# Altium project SCB.PrjPCB (part 4 of 6)

## Sheet SCB_PLLs.SchDoc
size A3
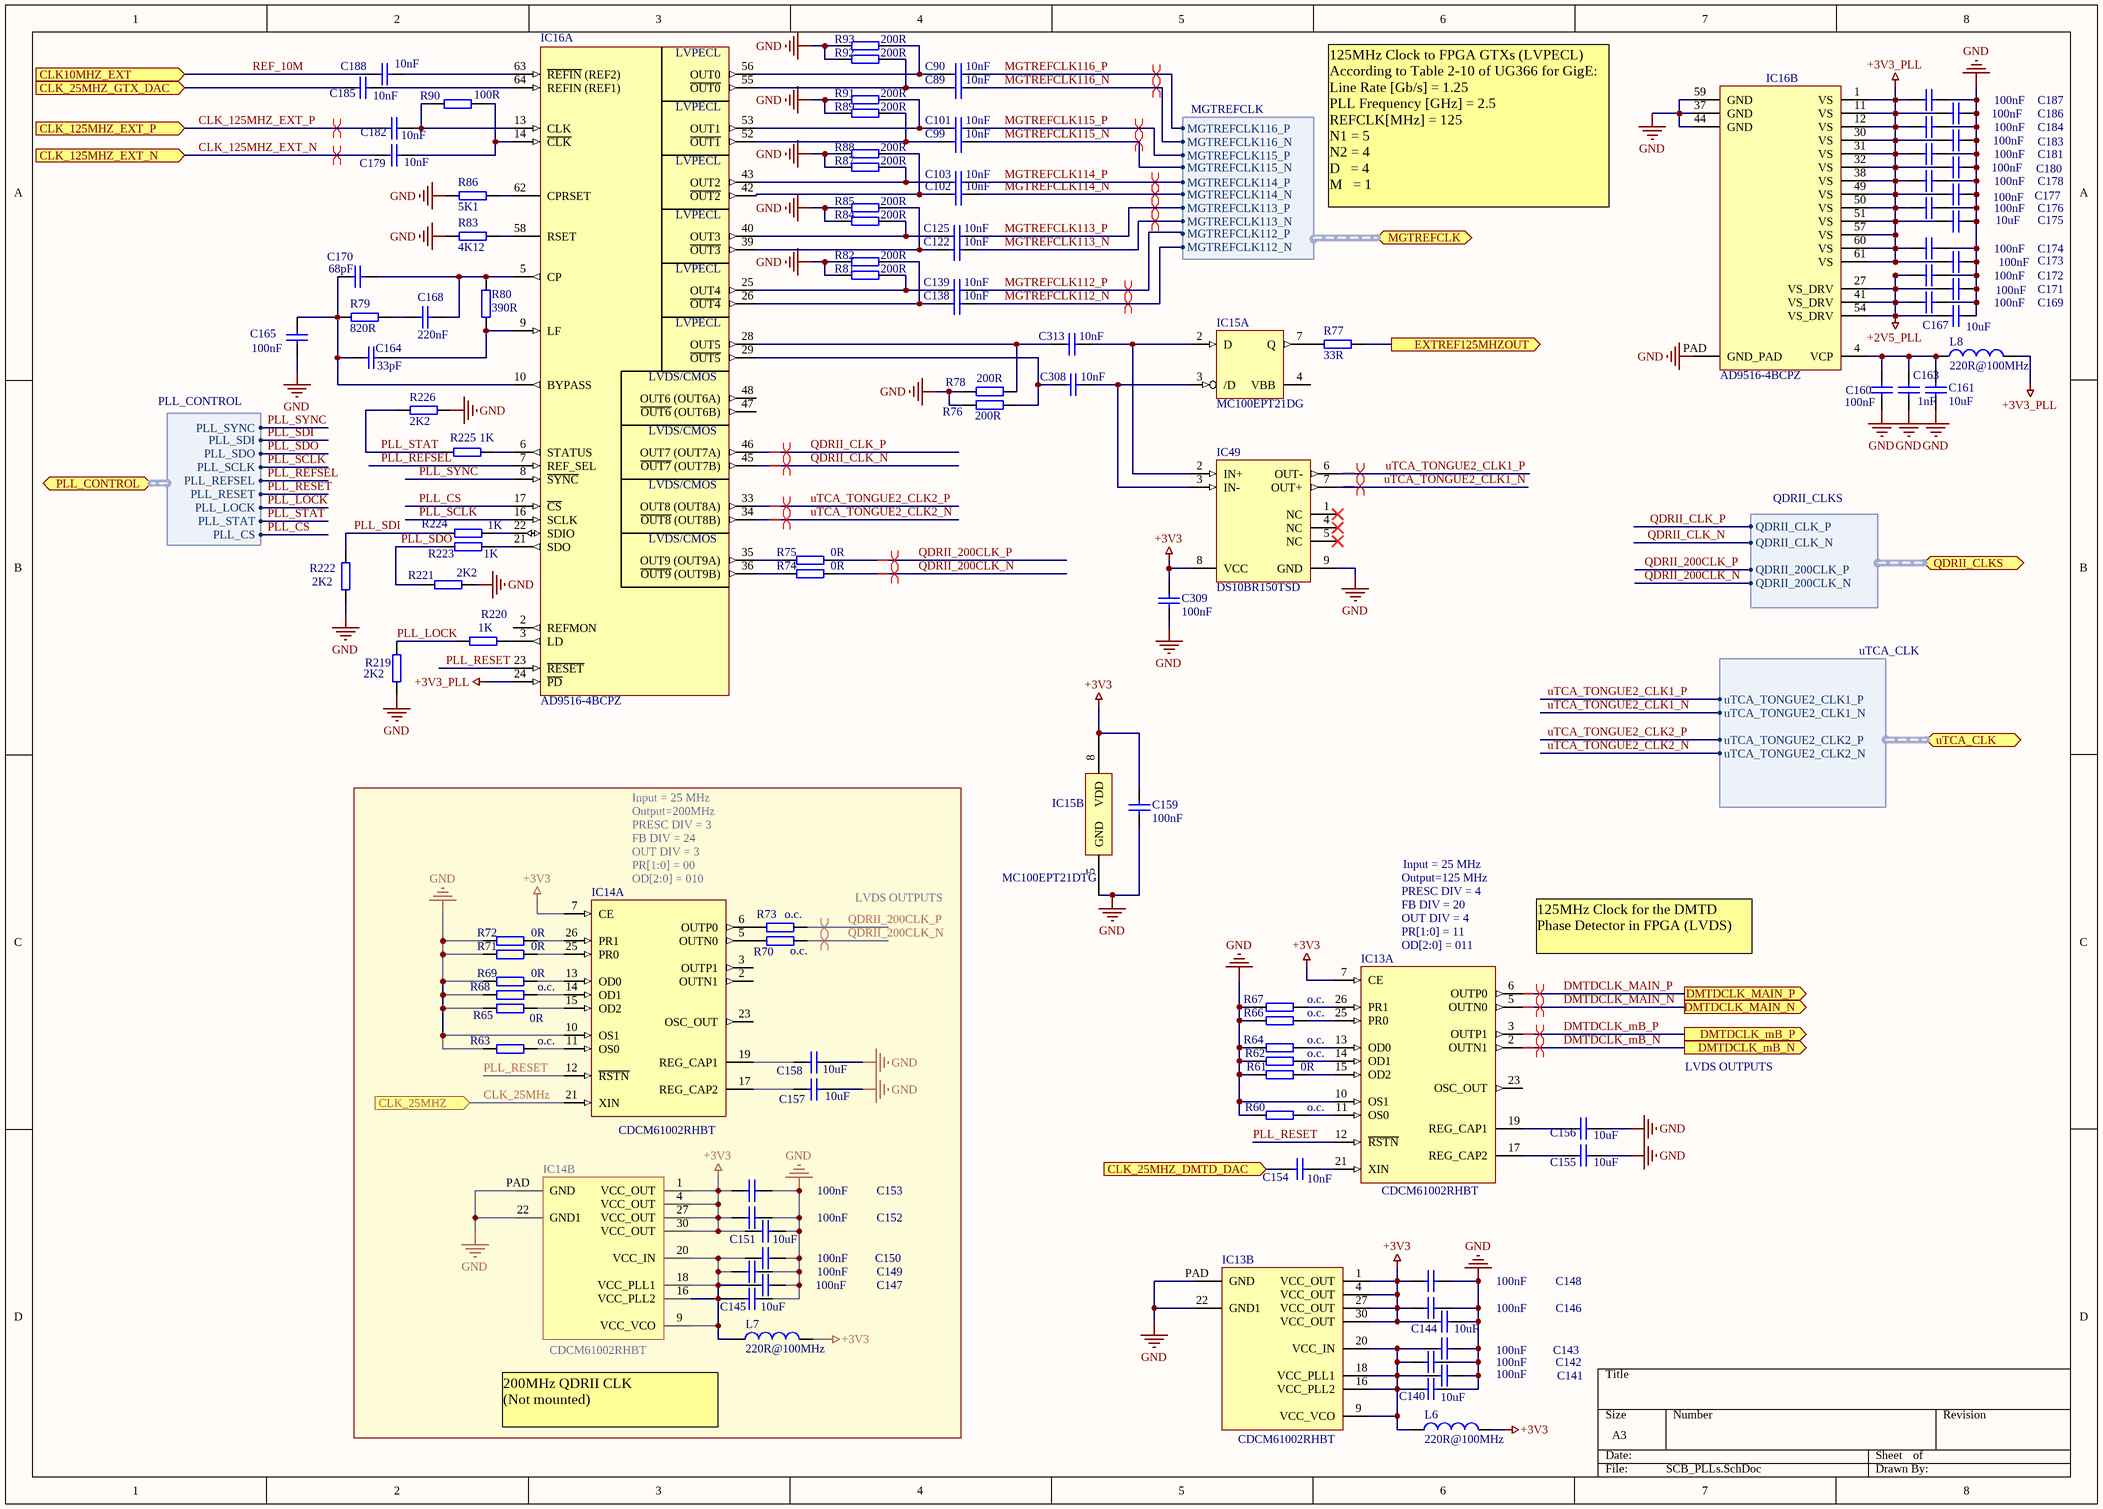
[diagram p14: SCB_PLLs.SchDoc]

### Parts
C89  10nF  [CC1005-0402]
C90  10nF  [CC1005-0402]
C99  10nF  [CC1005-0402]
C101  10nF  [CC1005-0402]
C102  10nF  [CC1005-0402]
C103  10nF  [CC1005-0402]
C122  10nF  [CC1005-0402]
C125  10nF  [CC1005-0402]
C138  10nF  [CC1005-0402]
C139  10nF  [CC1005-0402]
C140  10uF  [CC1608-0603]
C141  100nF  [CC1005-0402]
C142  100nF  [CC1005-0402]
C143  100nF  [CC1005-0402]
C144  10uF  [CC1608-0603]
C145  10uF  [CC1608-0603]
C146  100nF  [CC1005-0402]
C147  100nF  [CC1005-0402]
C148  100nF  [CC1005-0402]
C149  100nF  [CC1005-0402]
C150  100nF  [CC1005-0402]
C151  10uF  [CC1608-0603]
C152  100nF  [CC1005-0402]
C153  100nF  [CC1005-0402]
C154  10nF  [CC1005-0402]
C155  10uF  [CC1608-0603]
C156  10uF  [CC1608-0603]
C157  10uF  [CC1608-0603]
C158  10uF  [CC1608-0603]
C159  100nF  [CC1005-0402]
C160  100nF  [CC1005-0402]
C161  10uF  [CC1608-0603]
C163  1nF  [CC1005-0402]
C164  33pF  [CC1608-0603]
C165  100nF  [CC1608-0603]
C167  10uF  [CC1608-0603]
C168  220nF  [CC1608-0603]
C169  100nF  [CC1005-0402]
C170  68pF  [CC1608-0603]
C171  100nF  [CC1005-0402]
C172  100nF  [CC1005-0402]
C173  100nF  [CC1005-0402]
C174  100nF  [CC1005-0402]
C175  10uF  [CC1608-0603]
C176  100nF  [CC1005-0402]
C177  100nF  [CC1005-0402]
C178  100nF  [CC1005-0402]
C179  10nF  [CC1005-0402]
C180  100nF  [CC1005-0402]
C181  100nF  [CC1005-0402]
C182  10nF  [CC1005-0402]
C183  100nF  [CC1005-0402]
C184  100nF  [CC1005-0402]
C185  10nF  [CC1005-0402]
C186  100nF  [CC1005-0402]
C187  100nF  [CC1005-0402]
C188  10nF  [CC1005-0402]
C308  10nF  [CC1005-0402]
C309  100nF  [CC1005-0402]
C313  10nF  [CC1005-0402]
IC13  CDCM61002RHBT  [QFN32_POWERPAD]  (parts A,B of 2)
IC14  CDCM61002RHBT  [QFN32_POWERPAD]  (parts A,B of 2)
IC15  MC100EPT21DG  [SOIC127P600-8AL]  (parts A,B of 2)
IC16  AD9516-4BCPZ  [QFN50P900X900X100-64M]  (parts A,B of 2)
IC49  DS10BR150TSD  [SDA08A]
L6  Impedance: 220R@100MHz  [0603]  (hidden comment: 220R@100MHz Ferrite Bead)
L7  Impedance: 220R@100MHz  [0603]  (hidden comment: 220R@100MHz Ferrite Bead)
L8  Impedance: 220R@100MHz  [0603]  (hidden comment: 220R@100MHz Ferrite Bead)
R60  o.c.  [0402]
R61  value 0R  [0402]  (hidden comment: Jumper)
R62  o.c.  [0402]
R63  o.c.  [0402]
R64  o.c.  [0402]
R65  value 0R  [0402]  (hidden comment: Jumper)
R66  o.c.  [0402]
R67  o.c.  [0402]
R68  o.c.  [0402]
R69  value 0R  [0402]  (hidden comment: Jumper)
R70  o.c.  [0402]
R71  value 0R  [0402]  (hidden comment: Jumper)
R72  value 0R  [0402]  (hidden comment: Jumper)
R73  o.c.  [0402]
R74  value 0R  [0402]  (hidden comment: Jumper)
R75  value 0R  [0402]  (hidden comment: Jumper)
R76  200R  [0402]
R77  33R  [0603]
R78  200R  [0402]
R79  820R  [0603]
R80  390R  [0603]
R81  200R  [0402]
R82  200R  [0402]
R83  4K12  [0402]
R84  200R  [0402]
R85  200R  [0402]
R86  5K1  [0402]
R87  200R  [0402]
R88  200R  [0402]
R89  200R  [0402]
R90  100R  [0402]
R91  200R  [0402]
R92  200R  [0402]
R93  200R  [0402]
R219  2K2  [0402]
R220  1K  [0402]
R221  2K2  [0402]
R222  2K2  [0402]
R223  1K  [0402]
R224  1K  [0402]
R225  1K  [0402]
R226  2K2  [0402]

### Ports
CLK10MHZ_EXT (in), CLK_25MHZ (in), CLK_25MHZ_DMTD_DAC (in), CLK_25MHZ_GTX_DAC (in), CLK_125MHZ_EXT_N (in), CLK_125MHZ_EXT_P (in), DMTDCLK_MAIN_N (out), DMTDCLK_MAIN_P (out), DMTDCLK_mB_N (out), DMTDCLK_mB_P (out), EXTREF125MHZOUT (out), MGTREFCLK (harness MGTREFCLK), PLL_CONTROL (harness PLL_CONTROL), QDRII_CLKS (harness QDRII_CLKS), uTCA_CLK (harness uTCA_CLK)

### Harnesses
PLL_CONTROL: PLL_CS, PLL_STAT, PLL_LOCK, PLL_RESET, PLL_REFSEL, PLL_SCLK, PLL_SDO, PLL_SDI, PLL_SYNC
QDRII_CLKS: QDRII_CLK_P, QDRII_CLK_N, QDRII_200CLK_P, QDRII_200CLK_N
MGTREFCLK: MGTREFCLK112_P, MGTREFCLK112_N, MGTREFCLK113_P, MGTREFCLK113_N, MGTREFCLK114_P, MGTREFCLK114_N, MGTREFCLK115_P, MGTREFCLK115_N, MGTREFCLK116_P, MGTREFCLK116_N
uTCA_CLK: uTCA_TONGUE2_CLK1_P, uTCA_TONGUE2_CLK1_N, uTCA_TONGUE2_CLK2_P, uTCA_TONGUE2_CLK2_N

### Nets
+2V5_PLL: C167.1 C169.2 C171.2 C172.2 IC16.27(VS_DRV) IC16.41(VS_DRV) IC16.54(VS_DRV)
+3V3: C144.1 C146.2 C148.2 C151.1 C152.2 C153.2 C159.1 C309.1 IC13.1(VCC_OUT) IC13.4(VCC_OUT) IC13.7(CE) IC13.27(VCC_OUT) IC13.30(VCC_OUT) IC14.1(VCC_OUT) IC14.4(VCC_OUT) IC14.7(CE) IC14.27(VCC_OUT) IC14.30(VCC_OUT) IC15.8(VDD) IC49.8(VCC) L6.2 L7.2
+3V3_PLL: C173.2 C174.2 C175.1 C176.2 C177.2 C178.2 C180.2 C181.2 C183.2 C184.2 C186.2 C187.2 IC16.1(VS) IC16.11(VS) IC16.12(VS) IC16.24(~{PD}) IC16.30(VS) IC16.31(VS) IC16.32(VS) IC16.38(VS) IC16.49(VS) IC16.50(VS) IC16.51(VS) IC16.57(VS) IC16.60(VS) IC16.61(VS) L8.2
GND: C140.2 C141.1 C142.1 C143.1 C144.2 C145.2 C146.1 C147.1 C148.1 C149.1 C150.1 C151.2 C152.1 C153.1 C155.2 C156.2 C157.2 C158.2 C159.2 C160.2 C161.1 C163.1 C165.1 C167.2 C169.1 C171.1 C172.1 C173.1 C174.1 C175.2 C176.1 C177.1 C178.1 C180.1 C181.1 C183.1 C184.1 C186.1 C187.1 C309.2 IC13.10(OS1) IC13.22(GND1) IC13.PAD(GND) IC14.10(OS1) IC14.22(GND1) IC14.PAD(GND) IC15.5(GND) IC16.37(GND) IC16.44(GND) IC16.59(GND) IC16.PAD(GND_PAD) IC49.9(GND) R60.2 R61.1 R62.2 R63.2 R64.2 R65.1 R66.2 R67.2 R68.2 R69.1 R71.1 R72.1 R76.2 R78.2 R81.2 R82.2 R83.1 R84.2 R85.2 R86.1 R87.2 R88.2 R89.2 R91.2 R92.2 R93.2 R219.2 R221.2 R222.2 R226.2
CLK_25MHz: IC14.21(XIN) ; port CLK_25MHZ
CLK_125MHZ_EXT_N: C179.1 ; port CLK_125MHZ_EXT_N  [project net CLK125MHZ_EXT_N]
CLK_125MHZ_EXT_P: C182.1 ; port CLK_125MHZ_EXT_P  [project net CLK125MHZ_EXT_P]
DMTDCLK_MAIN_N: IC13.5(OUTN0) ; port DMTDCLK_MAIN_N  [project net DMTD_CLK_N]
DMTDCLK_MAIN_P: IC13.6(OUTP0) ; port DMTDCLK_MAIN_P  [project net DMTD_CLK_P]
DMTDCLK_mB_N: IC13.2(OUTN1) ; port DMTDCLK_mB_N
DMTDCLK_mB_P: IC13.3(OUTP1) ; port DMTDCLK_mB_P
MGTREFCLK112_N: C138.1 ; port MGTREFCLK.MGTREFCLK112_N  [project net MGTREFCLK.MGTREFCLK112_N]
MGTREFCLK112_P: C139.1 ; port MGTREFCLK.MGTREFCLK112_P  [project net MGTREFCLK.MGTREFCLK112_P]
MGTREFCLK113_N: C122.1 ; port MGTREFCLK.MGTREFCLK113_N  [project net MGTREFCLK.MGTREFCLK113_N]
MGTREFCLK113_P: C125.1 ; port MGTREFCLK.MGTREFCLK113_P  [project net MGTREFCLK.MGTREFCLK113_P]
MGTREFCLK114_N: C102.1 ; port MGTREFCLK.MGTREFCLK114_N  [project net MGTREFCLK.MGTREFCLK114_N]
MGTREFCLK114_P: C103.1 ; port MGTREFCLK.MGTREFCLK114_P  [project net MGTREFCLK.MGTREFCLK114_P]
MGTREFCLK115_N: C99.1 ; port MGTREFCLK.MGTREFCLK115_N  [project net MGTREFCLK.MGTREFCLK115_N]
MGTREFCLK115_P: C101.1 ; port MGTREFCLK.MGTREFCLK115_P  [project net MGTREFCLK.MGTREFCLK115_P]
MGTREFCLK116_N: C89.1 ; port MGTREFCLK.MGTREFCLK116_N  [project net MGTREFCLK.MGTREFCLK116_N]
MGTREFCLK116_P: C90.1 ; port MGTREFCLK.MGTREFCLK116_P  [project net MGTREFCLK.MGTREFCLK116_P]
PLL_CS: IC16.17(~{CS}) ; port PLL_CONTROL.PLL_CS  [project net PLL_CONTROL.PLL_CS]
PLL_LOCK: R219.1 R220.2 ; port PLL_CONTROL.PLL_LOCK  [project net PLL_CONTROL.PLL_LOCK]
PLL_REFSEL: IC16.7(REF_SEL) ; port PLL_CONTROL.PLL_REFSEL  [project net PLL_CONTROL.PLL_REFSEL]
PLL_RESET: IC13.12(~{RSTN}) IC14.12(~{RSTN}) IC16.23(~{RESET}) ; port PLL_CONTROL.PLL_RESET  [project net PLL_CONTROL.PLL_RESET]
PLL_SCLK: IC16.16(SCLK) ; port PLL_CONTROL.PLL_SCLK  [project net PLL_CONTROL.PLL_SCLK]
PLL_SDI: R222.1 R224.2 ; port PLL_CONTROL.PLL_SDI  [project net PLL_CONTROL.PLL_SDI]
PLL_SDO: R221.1 R223.2 ; port PLL_CONTROL.PLL_SDO  [project net PLL_CONTROL.PLL_SDO]
PLL_STAT: R225.2 R226.1 ; port PLL_CONTROL.PLL_STAT  [project net PLL_CONTROL.PLL_STAT]
PLL_SYNC: IC16.8(~{SYNC}) ; port PLL_CONTROL.PLL_SYNC  [project net PLL_CONTROL.PLL_SYNC]
QDRII_200CLK_N: R70.1 R74.2 ; port QDRII_CLKS.QDRII_200CLK_N
QDRII_200CLK_P: R73.1 R75.2 ; port QDRII_CLKS.QDRII_200CLK_P
QDRII_CLK_N: IC16.45(~{OUT7}_(OUT7B)) ; port QDRII_CLKS.QDRII_CLK_N
QDRII_CLK_P: IC16.46(OUT7_(OUT7A)) ; port QDRII_CLKS.QDRII_CLK_P
REF_10M: C188.1 ; port CLK10MHZ_EXT
uTCA_TONGUE2_CLK1_N: IC49.7(OUT+) ; port uTCA_CLK.uTCA_TONGUE2_CLK1_N  [project net uTCA_CLK.uTCA_TONGUE2_CLK1_N]
uTCA_TONGUE2_CLK1_P: IC49.6(OUT-) ; port uTCA_CLK.uTCA_TONGUE2_CLK1_P  [project net uTCA_CLK.uTCA_TONGUE2_CLK1_P]
uTCA_TONGUE2_CLK2_N: IC16.34(~{OUT8}_(OUT8B)) ; port uTCA_CLK.uTCA_TONGUE2_CLK2_N  [project net uTCA_CLK.uTCA_TONGUE2_CLK2_N]
uTCA_TONGUE2_CLK2_P: IC16.33(OUT8_(OUT8A)) ; port uTCA_CLK.uTCA_TONGUE2_CLK2_P  [project net uTCA_CLK.uTCA_TONGUE2_CLK2_P]
NetC89_2: C89.2 IC16.55(~{OUT0}) R92.1
NetC90_2: C90.2 IC16.56(OUT0) R93.1
NetC99_2: C99.2 IC16.52(~{OUT1}) R89.1
NetC101_2: C101.2 IC16.53(OUT1) R91.1
NetC102_2: C102.2 IC16.42(~{OUT2}) R88.1
NetC103_2: C103.2 IC16.43(OUT2) R87.1
NetC122_2: C122.2 IC16.39(~{OUT3}) R85.1
NetC125_2: C125.2 IC16.40(OUT3) R84.1
NetC138_2: C138.2 IC16.26(~{OUT4}) R82.1
NetC139_2: C139.2 IC16.25(OUT4) R81.1
NetC140_1: C140.1 C141.2 C142.2 C143.2 IC13.9(VCC_VCO) IC13.16(VCC_PLL2) IC13.18(VCC_PLL1) IC13.20(VCC_IN) L6.1
NetC145_1: C145.1 C147.2 C149.2 C150.2 IC14.9(VCC_VCO) IC14.16(VCC_PLL2) IC14.18(VCC_PLL1) IC14.20(VCC_IN) L7.1
NetC154_1: C154.1 IC13.21(XIN)
NetC154_2: C154.2 ; port CLK_25MHZ_DMTD_DAC
NetC155_1: C155.1 IC13.17(REG_CAP2)
NetC156_1: C156.1 IC13.19(REG_CAP1)
NetC157_1: C157.1 IC14.17(REG_CAP2)
NetC158_1: C158.1 IC14.19(REG_CAP1)
NetC160_1: C160.1 C161.2 C163.2 IC16.4(VCP) L8.1
NetC164_1: C164.1 C165.2 C170.1 IC16.10(BYPASS) R79.1
NetC164_2: C164.2 IC16.9(LF) R80.1
NetC168_1: C168.1 R79.2
NetC168_2: C168.2 C170.2 IC16.5(CP) R80.2
NetC179_2: C179.2 IC16.14(~{CLK}) R90.1
NetC182_2: C182.2 IC16.13(CLK) R90.2
NetC185_1: C185.1 ; port CLK_25MHZ_GTX_DAC
NetC185_2: C185.2 IC16.64(REFIN_(REF1))
NetC188_2: C188.2 IC16.63(~{REFIN}_(REF2))
NetC308_1: C308.1 IC15.3(/D) IC49.3(IN-)
NetC308_2: C308.2 IC16.29(~{OUT5}) R76.1
NetC313_1: C313.1 IC15.2(D) IC49.2(IN+)
NetC313_2: C313.2 IC16.28(OUT5) R78.1
NetIC13_11: IC13.11(OS0) R60.1
NetIC13_13: IC13.13(OD0) R64.1
NetIC13_14: IC13.14(OD1) R62.1
NetIC13_15: IC13.15(OD2) R61.2
NetIC13_25: IC13.25(PR0) R66.1
NetIC13_26: IC13.26(PR1) R67.1
NetIC14_5: IC14.5(OUTN0) R70.2
NetIC14_6: IC14.6(OUTP0) R73.2
NetIC14_11: IC14.11(OS0) R63.1
NetIC14_13: IC14.13(OD0) R69.2
NetIC14_14: IC14.14(OD1) R68.1
NetIC14_15: IC14.15(OD2) R65.2
NetIC14_25: IC14.25(PR0) R71.2
NetIC14_26: IC14.26(PR1) R72.2
NetIC15_7: IC15.7(Q) R77.1
NetIC16_3: IC16.3(LD) R220.1
NetIC16_6: IC16.6(STATUS) R225.1
NetIC16_21: IC16.21(SDO) R223.1
NetIC16_22: IC16.22(SDIO) R224.1
NetIC16_35: IC16.35(OUT9_(OUT9A)) R75.1
NetIC16_36: IC16.36(~{OUT9}_(OUT9B)) R74.1
NetIC16_58: IC16.58(RSET) R83.2
NetIC16_62: IC16.62(CPRSET) R86.2
NetP1_1: R77.2 ; port EXTREF125MHZOUT

Not connected (* = marked no-connect by the designer): IC13 23(OSC_OUT); IC14 2(OUTN1) 3(OUTP1) 23(OSC_OUT); IC15 4(VBB); IC16 2(REFMON) 47(~{OUT6}_(OUT6B)) 48(OUT6_(OUT6A)); IC49 1(NC)* 4(NC)* 5(NC)*

### Layout directives
differential pair: (no net found under the mark), CLK125MHZ_EXT_N, CLK125MHZ_EXT_P, DMTD_CLK_N, DMTD_CLK_P, DMTDCLK_mB_N, DMTDCLK_mB_P, MGTREFCLK.MGTREFCLK112_N, MGTREFCLK.MGTREFCLK112_P, MGTREFCLK.MGTREFCLK113_N, MGTREFCLK.MGTREFCLK113_P, MGTREFCLK.MGTREFCLK114_N, MGTREFCLK.MGTREFCLK114_P, MGTREFCLK.MGTREFCLK115_N, MGTREFCLK.MGTREFCLK115_P, MGTREFCLK.MGTREFCLK116_N, MGTREFCLK.MGTREFCLK116_P, QDRII_200CLK_N, QDRII_200CLK_P, QDRII_CLK_N, QDRII_CLK_P, uTCA_CLK.uTCA_TONGUE2_CLK2_N, uTCA_CLK.uTCA_TONGUE2_CLK2_P

### Notes on the sheet
- 125MHz Clock to FPGA GTXs (LVPECL)
  According to Table 2-10 of UG366 for GigE:
  Line Rate [Gb/s] = 1.25
  PLL Frequency [GHz] = 2.5
  REFCLK[MHz] = 125
  N1 = 5
  N2 = 4
  D   = 4
  M   = 1
- Output=200MHz
- PRESC DIV = 3
- FB DIV = 24
- OUT DIV = 3
- Input = 25 MHz
- (near IC14) PR[1:0] = 00
- (near IC14) OD[2:0] = 010
- LVDS OUTPUTS
- Output=125 MHz
- PRESC DIV = 4
- FB DIV = 20
- OUT DIV = 4
- (near IC13) PR[1:0] = 11
- (near IC13) OD[2:0] = 011
- (near IC13) 125MHz Clock for the DMTD Phase Detector in FPGA (LVDS)
- 200MHz QDRII CLK
  (Not mounted)
- (in symbol AD9516, part A) LVPECL; LVDS/CMOS

### Library data of the parts
C89 C90 C99 C101-C103 C122 C125 C138 C139 C154 C179 C182 C185 C188 C308 C313 = CC0402_10NF_25V_10%_X7R: Capacitor; Manufacturer1: TDK; Manufacturer1 PN: C1005X7R1E103K; TC: X7R; Tolerance: ±10%; Voltage: 25V; Published: 8-Jun-2000; LatestRevisionDate: 17-Jul-2002; LatestRevisionNote: Re-released for DXP Platform.; PackageReference: RAD-0.3; Publisher: Altium Limited; Distributor1: Digikey; Distributor1 PN: 445-1260-1-ND; Case: 0402; Value: 10nF
C140 C144 C145 C151 C155-C158 C161 C167 C175 = CC0603_10UF_6.3V_20%_X5R: Capacitor; Manufacturer1: TDK; Manufacturer1 PN: C1608X5R0J106M; TC: X5R; Tolerance: ±20%; Voltage: 6.3V; Published: 8-Jun-2000; LatestRevisionDate: 17-Jul-2002; LatestRevisionNote: Re-released for DXP Platform.; PackageReference: RAD-0.3; Publisher: Altium Limited; Distributor1: Digikey; Distributor1 PN: 445-4112-1-ND; Case: 0603; Value: 10uF
C141-C143 C146-C150 C152 C153 C159 C160 C169 C171-C174 C176-C178 C180 C181 C183 C184 C186 C187 C309 = CC0402_100NF_16V_10%_X7R: Capacitor; Manufacturer1: TDK; Manufacturer1 PN: C1005X7R1C104K; TC: X7R; Tolerance: ±10%; Voltage: 16V; Published: 8-Jun-2000; LatestRevisionDate: 17-Jul-2002; LatestRevisionNote: Re-released for DXP Platform.; PackageReference: RAD-0.3; Publisher: Altium Limited; Distributor1: Digikey; Distributor1 PN: 445-4952-1-ND; Case: 0402; Value: 100nF
C163 = CC0402_1NF_25V_10%_X7R: Capacitor; Manufacturer1: TDK; Manufacturer1 PN: C1005X7R1E102K; TC: X7R; Tolerance: ±10%; Voltage: 25V; Published: 8-Jun-2000; LatestRevisionDate: 17-Jul-2002; LatestRevisionNote: Re-released for DXP Platform.; PackageReference: RAD-0.3; Publisher: Altium Limited; Distributor1: Digikey; Distributor1 PN: 445-4924-1-ND; Case: 0402; Value: 1nF
C164 = CC0603_33PF_50V_5%_NP0: Capacitor; Manufacturer1: TDK; Manufacturer1 PN: C1608C0G1H330J; TC: COG; Tolerance: ±5%; Voltage: 50V; Published: 8-Jun-2000; LatestRevisionDate: 17-Jul-2002; LatestRevisionNote: Re-released for DXP Platform.; PackageReference: RAD-0.3; Publisher: Altium Limited; Distributor1: Digikey; Distributor1 PN: 445-1275-1-ND; Case: 0402; Value: 33pF
C165 = CC0603_100NF_50V_10%_X7R: Capacitor; Manufacturer1: Phycomp; Manufacturer1 PN: CC0603KRX7R9BB104; TC: X7R; Tolerance: ±10%; Voltage: 50V; Published: 8-Jun-2000; LatestRevisionDate: 17-Jul-2002; LatestRevisionNote: Re-released for DXP Platform.; Publisher: Altium Limited; Distributor1: Digikey; Distributor1 PN: 311-1344-1-ND; Case: 0603; Value: 100nF
C168 = CC0603_220NF_10V_10%_X7R: Capacitor; Manufacturer1: Yageo; Manufacturer1 PN: CC0603KRX7R6BB224; TC: X7R; Tolerance: ±10%; Voltage: 10V; Published: 8-Jun-2000; LatestRevisionDate: 17-Jul-2002; LatestRevisionNote: Re-released for DXP Platform.; PackageReference: RAD-0.3; Publisher: Altium Limited; Distributor1: Digikey; Distributor1 PN: 311-1346-1-ND; Case: 0402; Value: 220nF
C170 = CC0603_68PF_50V_5%_NP0: Capacitor; Manufacturer1: TDK Corporation; Manufacturer1 PN: C1608C0G1H680J; TC: COG; Tolerance: ±5%; Voltage: 50V; Published: 8-Jun-2000; LatestRevisionDate: 17-Jul-2002; LatestRevisionNote: Re-released for DXP Platform.; PackageReference: RAD-0.3; Publisher: Altium Limited; Distributor1: Digikey; Distributor1 PN: 445-1279-1-ND; Case: 0402; Value: 68pF
IC13 IC14 = CDCM61002: Low Jitter Clock Generator, Two Outpust, Integrated VCO; Manufacturer: Texas Instruments; Value: CDCM61002RHBT; Distributor1: Digikey; Distributor1 PN: 296-24193-1-ND
IC15 = MC100EPT21: ONSemi LVDS/LVPECL -> LVTTL/LVCMOS buffer; RefId: MC100EPT21DGOS-ND; Supplier: Digikey; Value: MC100EPT21DG
IC16 = AD9516: PLL with clock fanout; Value: AD9516-4BCPZ; Distributor1 PN: AD9516-4BCPZ-ND; Distributor1: Digikey
IC49 = DS10BR150TSD: 1.0 Gbps LVDS Buffer/Repeater; Manufacturer: National Semiconductor; CompType: Interface IC; PackageTopMarking: ZXYTT*1R150; PowerWise: N; Published: 4-Dec-2008; DatasheetVersion: Nov-2007; PackageVersion: revA, Aug-2003; PackageReference: SDA08A; Publisher: Altium Limited; PackageDescription: LLP, Plastic, Dual, 3 x 3 x 0.8mm Body, 8 Lead, 0.5mm Pitch, No Pullback; PartNumber: DS10BR150TSD; RoHS: Y; PinCount: 8; DigiKeyPartNumber: DS10BR150TSDTR-ND; ComponentLink1Description: DS10BR150 Datasheet; ComponentLink1URL: http://www.national.com/ds/DS/DS10BR150.pdf; ComponentLink2Description: DS10BR150 Web Page; ComponentLink2URL: http://www.national.com/pf/DS/DS10BR150.html; ComponentLink3Description: SDA08A Package Page; ComponentLink3URL: http://www.national.com/packaging/folders/sda08a.html
L6-L8 = L_FERRITE_BEAD: ferrite bead; Manufacturer1: Murata; Manufacturer1 PN: BLM18KG221SN1D; Current Rating: 2.2A; DCR: 50mOhm; Case: 0603; Distributor1: Digikey; Distributor1 PN: 490-5255-1-ND
R60 R62-R64 R66-R68 R70 R73 = R0402_O.C.: SMD Resistor; Case: 0402; Manufacturer1: N/A; Manufacturer1 PN: N/A; Distributor1: N/A; Distributor1 PN: N/A; TCR: N/A; Power Rating: N/A; Tolerance: N/A; Value: o.c.
R61 R65 R69 R71 R72 R74 R75 = R0402_0R_0.1W_JUMPER: SMD Resistor; Manufacturer1: Panasonic; Manufacturer1 PN: ERJ-2GE0R00X; TCR: 100ppm; Power Rating: 0.1W; Case: 0402; Distributor1: DigiKey; Distributor1 PN: P0.0JCT-ND; Tolerance: Jumper
R76 R78 R81 R82 R84 R85 R87-R89 R91-R93 = R0402_200R_±1%_0.1W_100PPM: SMD Resistor; Manufacturer1: Panasonic; Manufacturer1 PN: ERJ-2RKF2000X; TCR: 100ppm; Power Rating: 0.1W; Tolerance: ±1%; Case: 0402; Distributor1: DigiKey; Distributor1 PN: P200LCT-ND; Value: 200R
R77 = R0603_33R_±1%_0.25W_100PPM: SMD Resistor; Manufacturer1: Vishay/Dale; Manufacturer1 PN: CRCW060333R0FKEAHP; TCR: 100ppm; Power Rating: 0.25W; Tolerance: ±1%; Case: 0402; Distributor1: DigiKey; Distributor1 PN: 541-33.0SCT-ND; Value: 33R
R79 = R0603_820R_±1%_0.1W_100PPM: SMD Resistor; Manufacturer1: Panasonic; Manufacturer1 PN: ERJ-3EKF8200V; TCR: 100ppm; Power Rating: 0.1W; Tolerance: ±1%; Case: 0603; Distributor1: DigiKey; Distributor1 PN: P820HCT-ND; Value: 820R
R80 = R0603_390R_±1%_0.1W_100PPM: SMD Resistor; Manufacturer1: Panasonic; Manufacturer1 PN: ERJ-3EKF3900V; TCR: 100ppm; Power Rating: 0.1W; Tolerance: ±1%; Case: 0603; Distributor1: DigiKey; Distributor1 PN: P390HCT-ND; Value: 390R
R83 = R0402_4K12_±1%_0.1W_100PPM: SMD Resistor; Manufacturer1: Panasonic; Manufacturer1 PN: ERJ-2RKF4121X; TCR: 100ppm; Power Rating: 0.1W; Tolerance: ±1%; Case: 0402; Distributor1: DigiKey; Distributor1 PN: P4.12KLCT-ND; Value: 4K12
R86 = R0402_5K1_±1%_0.1W_100PPM: SMD Resistor; Manufacturer1: Panasonic; Manufacturer1 PN: ERJ-2RKF5101X; TCR: 100ppm; Power Rating: 0.1W; Tolerance: ±1%; Case: 0402; Distributor1: DigiKey; Distributor1 PN: P5.10KLCT-ND; Value: 5K1
R90 = R0402_100R_±1%_0.1W_100PPM: SMD Resistor; Manufacturer1: Panasonic; Manufacturer1 PN: ERJ-2RKF1000X; TCR: 100ppm; Power Rating: 0.1W; Tolerance: ±1%; Case: 0402; Distributor1: DigiKey; Distributor1 PN: P100LCT-ND; Value: 100R
R219 R221 R222 R226 = R0402_2K2_±1%_0.1W_100PPM: SMD Resistor; Manufacturer1: Panasonic; Manufacturer1 PN: ERJ-2RKF2201X; TCR: 100ppm; Power Rating: 0.1W; Tolerance: ±1%; Case: 0402; Distributor1: DigiKey; Distributor1 PN: P2.20KLCT-ND; Value: 2K2
R220 R223-R225 = R0402_1K_±1%_0.1W_100PPM: as R160-R163 on sheet CPU_IO_Ports; Case: 0402; Distributor1: DigiKey; Distributor1 PN: P1.00KLCT-ND; Value: 1K

## Sheet FPGA_GPIOs.SchDoc
size A4
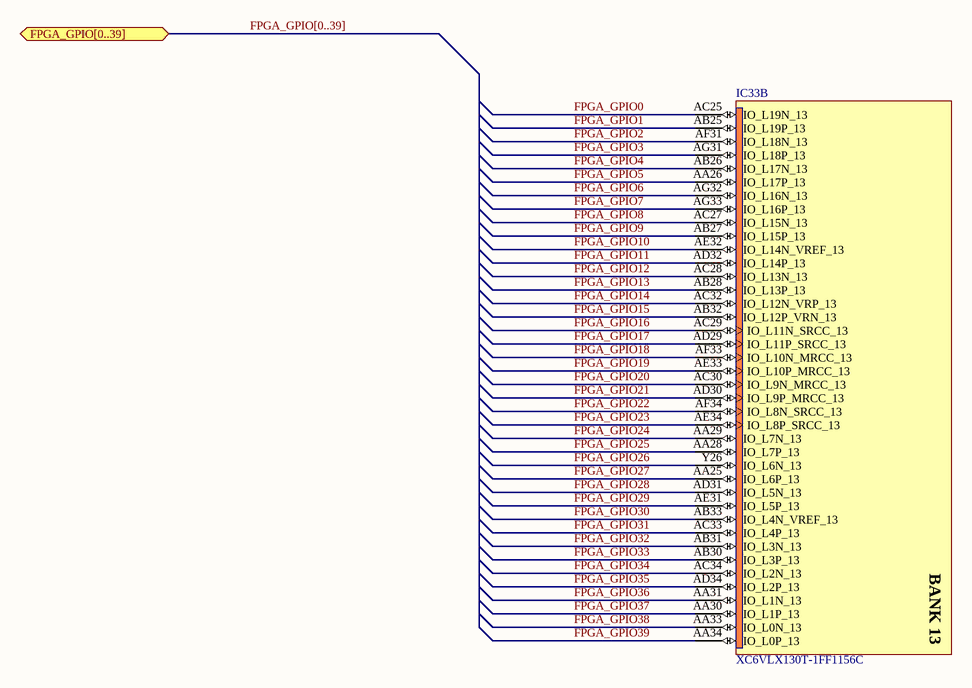
[diagram p15: FPGA_GPIOs.SchDoc]

### Parts
IC33  XC6VLX130T-1FF1156C  [FF1156]  (part B of 20)

### Ports
FPGA_GPIO[0..39] (bidir)

### Nets
FPGA_GPIO0: IC33.AC25(IO_L19N_13)
FPGA_GPIO1: IC33.AB25(IO_L19P_13)
FPGA_GPIO2: IC33.AF31(IO_L18N_13)
FPGA_GPIO3: IC33.AG31(IO_L18P_13)
FPGA_GPIO4: IC33.AB26(IO_L17N_13)
FPGA_GPIO5: IC33.AA26(IO_L17P_13)
FPGA_GPIO6: IC33.AG32(IO_L16N_13)
FPGA_GPIO7: IC33.AG33(IO_L16P_13)
FPGA_GPIO8: IC33.AC27(IO_L15N_13)
FPGA_GPIO9: IC33.AB27(IO_L15P_13)
FPGA_GPIO10: IC33.AE32(IO_L14N_VREF_13)
FPGA_GPIO11: IC33.AD32(IO_L14P_13)
FPGA_GPIO12: IC33.AC28(IO_L13N_13)
FPGA_GPIO13: IC33.AB28(IO_L13P_13)
FPGA_GPIO14: IC33.AC32(IO_L12N_VRP_13)
FPGA_GPIO15: IC33.AB32(IO_L12P_VRN_13)
FPGA_GPIO16: IC33.AC29(IO_L11N_SRCC_13)
FPGA_GPIO17: IC33.AD29(IO_L11P_SRCC_13)
FPGA_GPIO18: IC33.AF33(IO_L10N_MRCC_13)
FPGA_GPIO19: IC33.AE33(IO_L10P_MRCC_13)
FPGA_GPIO20: IC33.AC30(IO_L9N_MRCC_13)
FPGA_GPIO21: IC33.AD30(IO_L9P_MRCC_13)
FPGA_GPIO22: IC33.AF34(IO_L8N_SRCC_13)
FPGA_GPIO23: IC33.AE34(IO_L8P_SRCC_13)
FPGA_GPIO24: IC33.AA29(IO_L7N_13)
FPGA_GPIO25: IC33.AA28(IO_L7P_13)
FPGA_GPIO26: IC33.Y26(IO_L6N_13)
FPGA_GPIO27: IC33.AA25(IO_L6P_13)
FPGA_GPIO28: IC33.AD31(IO_L5N_13)
FPGA_GPIO29: IC33.AE31(IO_L5P_13)
FPGA_GPIO30: IC33.AB33(IO_L4N_VREF_13)
FPGA_GPIO31: IC33.AC33(IO_L4P_13)
FPGA_GPIO32: IC33.AB31(IO_L3N_13)
FPGA_GPIO33: IC33.AB30(IO_L3P_13)
FPGA_GPIO34: IC33.AC34(IO_L2N_13)
FPGA_GPIO35: IC33.AD34(IO_L2P_13)
FPGA_GPIO36: IC33.AA31(IO_L1N_13)
FPGA_GPIO37: IC33.AA30(IO_L1P_13)
FPGA_GPIO38: IC33.AA33(IO_L0N_13)
FPGA_GPIO39: IC33.AA34(IO_L0P_13)

### Buses and harness runs
bus FPGA_GPIO[0..39] = port FPGA_GPIO[0..39]

### Notes on the sheet
- (in symbol XC6VLX130T-1FF1156C, part B) BANK 13

### Library data of the parts
IC33 = XC6VLX130T-1FF1156C: Virtex-6 LXT Platform FPGA, 600 User I/Os, 20 GTXs, 1156-Ball FFBGA, Speed Grade 1, Commercial Grade; FirstPublished: 17-Nov-2009; DatasheetVersion: v2.0, Sep-2009; PackageVersion: ver1.0, Jun-2009; PackageReference: FF1156; Publisher: Altium Limited; PackageDescription: 1156-Ball Flip-Chip Fine Pitch Ball Grid Array (FF1156); Code_JEDEC: MS-034-AAR-1; Code_IPC: BGA100P34X34-1156; ComponentLink1Description: Virtex-6 Datasheet; ComponentLink1URL: http://www.xilinx.com/support/documentation/data_sheets/ds150.pdf; ComponentLink2Description: Pinout Specification; ComponentLink2URL: http://www.xilinx.com/support/packagefiles/virtex-6-pkgs.htm; ComponentLink3Description: FF1156 Package Drawing; ComponentLink3URL: http://www.xilinx.com/support/documentation/package_specs/ff1156.pdf; ComponentLink4Description: Virtex-6 Documents; ComponentLink4URL: http://www.xilinx.com/support/documentation/virtex-6.htm; ComponentLink5Description: Xilinx.com Home; ComponentLink5URL: http://www.xilinx.com

## Sheet FPGA_System_Monitor.SchDoc
size A3
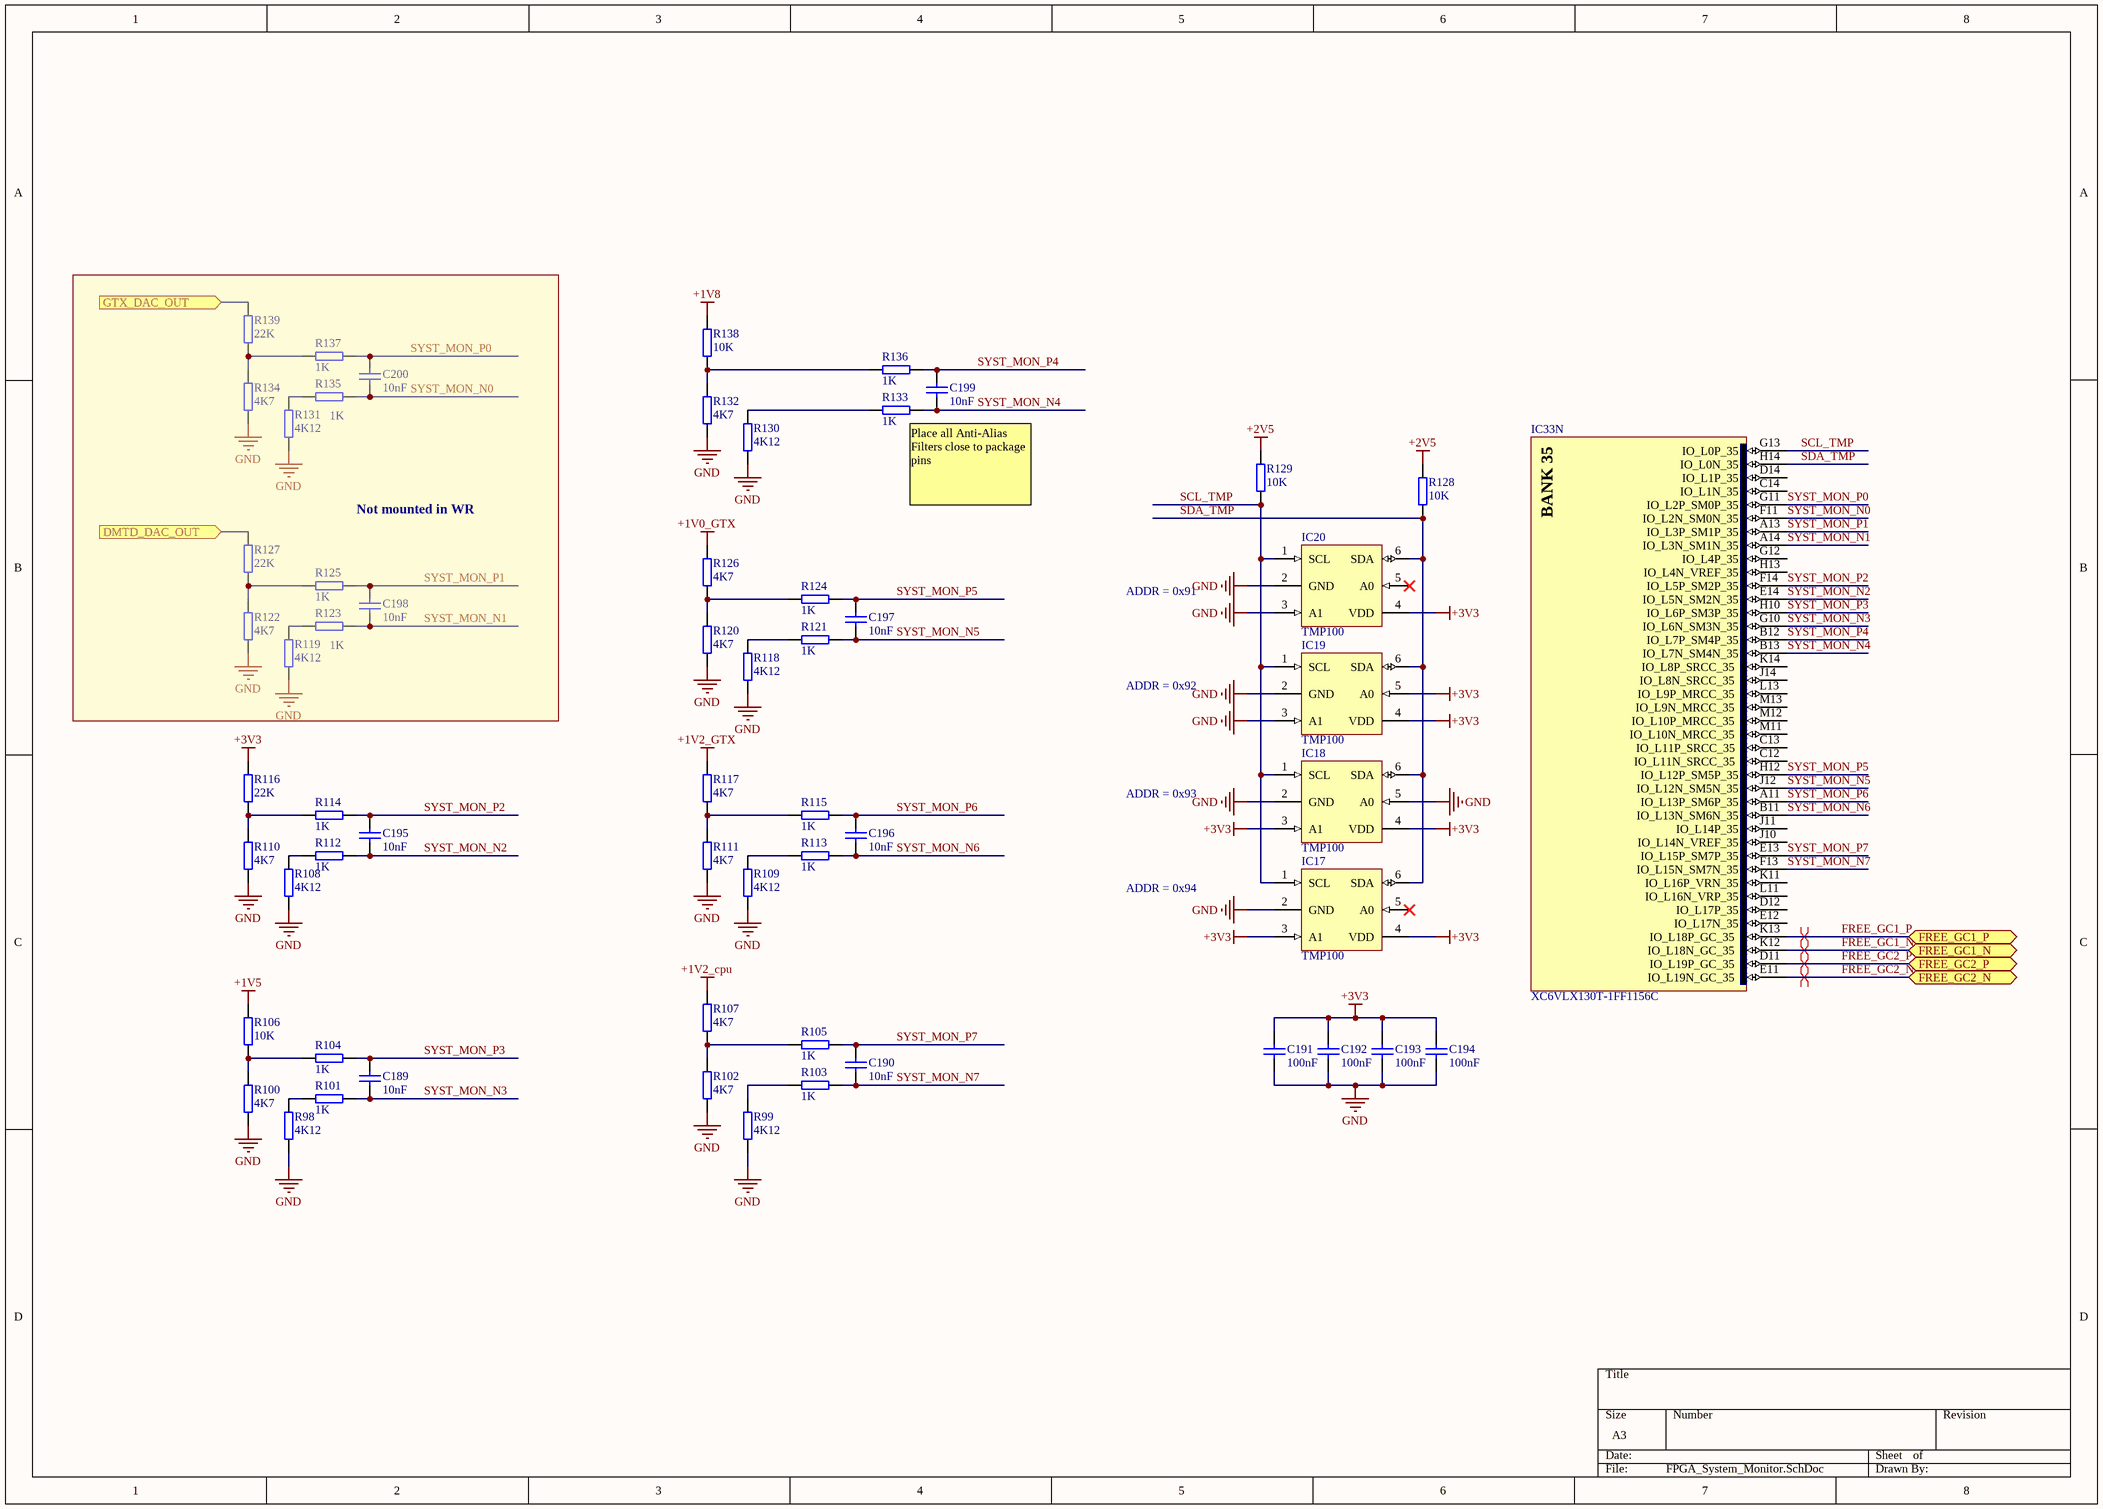
[diagram p16: FPGA_System_Monitor.SchDoc]

### Parts
C189  10nF  [CC1005-0402]
C190  10nF  [CC1005-0402]
C191  100nF  [CC1005-0402]
C192  100nF  [CC1005-0402]
C193  100nF  [CC1005-0402]
C194  100nF  [CC1005-0402]
C195  10nF  [CC1005-0402]
C196  10nF  [CC1005-0402]
C197  10nF  [CC1005-0402]
C198  10nF  [CC1005-0402]
C199  10nF  [CC1005-0402]
C200  10nF  [CC1005-0402]
IC17  TMP100  [SOT23A-6L]
IC18  TMP100  [SOT23A-6L]
IC19  TMP100  [SOT23A-6L]
IC20  TMP100  [SOT23A-6L]
IC33  XC6VLX130T-1FF1156C  [FF1156]  (part N of 20)
R98  4K12  [0402]
R99  4K12  [0402]
R100  4K7  [0402]
R101  1K  [0402]
R102  4K7  [0402]
R103  1K  [0402]
R104  1K  [0402]
R105  1K  [0402]
R106  10k  [0402]
R107  4K7  [0402]
R108  4K12  [0402]
R109  4K12  [0402]
R110  4K7  [0402]
R111  4K7  [0402]
R112  1K  [0402]
R113  1K  [0402]
R114  1K  [0402]
R115  1K  [0402]
R116  22K  [0402]
R117  4K7  [0402]
R118  4K12  [0402]
R119  4K12  [0402]
R120  4K7  [0402]
R121  1K  [0402]
R122  4K7  [0402]
R123  1K  [0402]
R124  1K  [0402]
R125  1K  [0402]
R126  4K7  [0402]
R127  22K  [0402]
R128  10k  [0402]
R129  10k  [0402]
R130  4K12  [0402]
R131  4K12  [0402]
R132  4K7  [0402]
R133  1K  [0402]
R134  4K7  [0402]
R135  1K  [0402]
R136  1K  [0402]
R137  1K  [0402]
R138  10k  [0402]
R139  22K  [0402]

### Blocks framed on the sheet
Not mounted in WR: C198 C200 R119 R122 R123 R125 R127 R131 R134 R135 R137 R139

### Ports
DMTD_DAC_OUT (in), FREE_GC1_N (bidir), FREE_GC1_P (bidir), FREE_GC2_N (bidir), FREE_GC2_P (bidir), GTX_DAC_OUT (in)

### Nets
+1V0_GTX: R126.2
+1V2_cpu: R107.2
+1V2_GTX: R117.2
+1V5: R106.2
+1V8: R138.2
+2V5: R128.2 R129.2
+3V3: C191.1 C192.1 C193.1 C194.1 IC17.3(A1) IC17.4(VDD) IC18.3(A1) IC18.4(VDD) IC19.4(VDD) IC19.5(A0) IC20.4(VDD) R116.2
GND: C191.2 C192.2 C193.2 C194.2 IC17.2(GND) IC18.2(GND) IC18.5(A0) IC19.2(GND) IC19.3(A1) IC20.2(GND) IC20.3(A1) R98.1 R99.1 R100.1 R102.1 R108.1 R109.1 R110.1 R111.1 R118.1 R119.1 R120.1 R122.1 R130.1 R131.1 R132.1 R134.1
FREE_GC1_N: IC33.K12(IO_L18N_GC_35) ; port FREE_GC1_N
FREE_GC1_P: IC33.K13(IO_L18P_GC_35) ; port FREE_GC1_P
FREE_GC2_N: IC33.E11(IO_L19N_GC_35) ; port FREE_GC2_N  [project net FPGA_GCLK_N]
FREE_GC2_P: IC33.D11(IO_L19P_GC_35) ; port FREE_GC2_P  [project net FPGA_GCLK_P]
SCL_TMP: IC17.1(SCL) IC18.1(SCL) IC19.1(SCL) IC20.1(SCL) IC33.G13(IO_L0P_35) R129.1
SDA_TMP: IC17.6(SDA) IC18.6(SDA) IC19.6(SDA) IC20.6(SDA) IC33.H14(IO_L0N_35) R128.1
SYST_MON_N0: C200.1 IC33.F11(IO_L2N_SM0N_35) R135.1
SYST_MON_N1: C198.1 IC33.A14(IO_L3N_SM1N_35) R123.1
SYST_MON_N2: C195.1 IC33.E14(IO_L5N_SM2N_35) R112.1
SYST_MON_N3: C189.1 IC33.G10(IO_L6N_SM3N_35) R101.1
SYST_MON_N4: C199.1 IC33.B13(IO_L7N_SM4N_35) R133.1
SYST_MON_N5: C197.1 IC33.J12(IO_L12N_SM5N_35) R121.1
SYST_MON_N6: C196.1 IC33.B11(IO_L13N_SM6N_35) R113.1
SYST_MON_N7: C190.1 IC33.F13(IO_L15N_SM7N_35) R103.1
SYST_MON_P0: C200.2 IC33.G11(IO_L2P_SM0P_35) R137.1
SYST_MON_P1: C198.2 IC33.A13(IO_L3P_SM1P_35) R125.1
SYST_MON_P2: C195.2 IC33.F14(IO_L5P_SM2P_35) R114.1
SYST_MON_P3: C189.2 IC33.H10(IO_L6P_SM3P_35) R104.1
SYST_MON_P4: C199.2 IC33.B12(IO_L7P_SM4P_35) R136.1
SYST_MON_P5: C197.2 IC33.H12(IO_L12P_SM5P_35) R124.1
SYST_MON_P6: C196.2 IC33.A11(IO_L13P_SM6P_35) R115.1
SYST_MON_P7: C190.2 IC33.E13(IO_L15P_SM7P_35) R105.1
NetIC5_3: R139.2 ; port GTX_DAC_OUT
NetIC8_3: R127.2 ; port DMTD_DAC_OUT
NetR98_2: R98.2 R101.2
NetR99_2: R99.2 R103.2
NetR100_2: R100.2 R104.2 R106.1
NetR102_2: R102.2 R105.2 R107.1
NetR108_2: R108.2 R112.2
NetR109_2: R109.2 R113.2
NetR110_2: R110.2 R114.2 R116.1
NetR111_2: R111.2 R115.2 R117.1
NetR118_2: R118.2 R121.2
NetR119_2: R119.2 R123.2
NetR120_2: R120.2 R124.2 R126.1
NetR122_2: R122.2 R125.2 R127.1
NetR130_2: R130.2 R133.2
NetR131_2: R131.2 R135.2
NetR132_2: R132.2 R136.2 R138.1
NetR134_2: R134.2 R137.2 R139.1

Not connected (* = marked no-connect by the designer): IC17 5(A0)*; IC20 5(A0)*; IC33 C12(IO_L11N_SRCC_35) C13(IO_L11P_SRCC_35) C14(IO_L1N_35) D12(IO_L17P_35) D14(IO_L1P_35) E12(IO_L17N_35) G12(IO_L4P_35) H13(IO_L4N_VREF_35) J10(IO_L14N_VREF_35) J11(IO_L14P_35) J14(IO_L8N_SRCC_35) K11(IO_L16P_VRN_35) K14(IO_L8P_SRCC_35) L11(IO_L16N_VRP_35) L13(IO_L9P_MRCC_35) M11(IO_L10N_MRCC_35) M12(IO_L10P_MRCC_35) M13(IO_L9N_MRCC_35)

### Layout directives
differential pair: FPGA_GCLK_N, FPGA_GCLK_P, FREE_GC1_N, FREE_GC1_P

### Notes on the sheet
- (near R133) Place all Anti-Alias Filters close to package pins
- ADDR = 0x91
- ADDR = 0x92
- ADDR = 0x93
- ADDR = 0x94
- (in symbol XC6VLX130T-1FF1156C, part N) BANK 35

### Library data of the parts
C189 C190 C195-C200 = CC0402_10NF_25V_10%_X7R: as C89 on sheet SCB_PLLs; Published: 8-Jun-2000; LatestRevisionDate: 17-Jul-2002; LatestRevisionNote: Re-released for DXP Platform.; PackageReference: RAD-0.3; Publisher: Altium Limited; Distributor1: Digikey; Distributor1 PN: 445-1260-1-ND; Case: 0402; Value: 10nF
C191-C194 = CC0402_100NF_16V_10%_X7R: as C141 on sheet SCB_PLLs; Published: 8-Jun-2000; LatestRevisionDate: 17-Jul-2002; LatestRevisionNote: Re-released for DXP Platform.; PackageReference: RAD-0.3; Publisher: Altium Limited; Distributor1: Digikey; Distributor1 PN: 445-4952-1-ND; Case: 0402; Value: 100nF
IC17-IC20 = TMP100: I2C temp. sensor; RefId: 296-12750-1-ND; Value: TMP101NA/250; Supplier: Digikey
IC33 = XC6VLX130T-1FF1156C: as IC33 on sheet FPGA_GPIOs; FirstPublished: 17-Nov-2009; DatasheetVersion: v2.0, Sep-2009; PackageVersion: ver1.0, Jun-2009; PackageReference: FF1156; Publisher: Altium Limited; PackageDescription: 1156-Ball Flip-Chip Fine Pitch Ball Grid Array (FF1156); Code_JEDEC: MS-034-AAR-1; Code_IPC: BGA100P34X34-1156; ComponentLink1Description: Virtex-6 Datasheet; ComponentLink1URL: http://www.xilinx.com/support/documentation/data_sheets/ds150.pdf; ComponentLink2Description: Pinout Specification; ComponentLink2URL: http://www.xilinx.com/support/packagefiles/virtex-6-pkgs.htm; ComponentLink3Description: FF1156 Package Drawing; ComponentLink3URL: http://www.xilinx.com/support/documentation/package_specs/ff1156.pdf; ComponentLink4Description: Virtex-6 Documents; ComponentLink4URL: http://www.xilinx.com/support/documentation/virtex-6.htm; ComponentLink5Description: Xilinx.com Home; ComponentLink5URL: http://www.xilinx.com
R98 R99 R108 R109 R118 R119 R130 R131 = R0402_4K12_±1%_0.1W_100PPM: as R83 on sheet SCB_PLLs; Case: 0402; Distributor1: DigiKey; Distributor1 PN: P4.12KLCT-ND; Value: 4K12
R100 R102 R107 R110 R111 R117 R120 R122 R126 R132 R134 = R0402_4.7K_±1%_0.1W_100PPM: SMD Resistor; Manufacturer1: Panasonic; Manufacturer1 PN: ERJ-2RKF4701X; TCR: 100ppm; Power Rating: 0.1W; Tolerance: ±1%; Case: 0402; Distributor1: DigiKey; Distributor1 PN: ERJ-2RKF4701X; Value: 4K7
R101 R103-R105 R112-R115 R121 R123-R125 R133 R135-R137 = R0402_1K_±1%_0.1W_100PPM: as R160-R163 on sheet CPU_IO_Ports; Case: 0402; Distributor1: DigiKey; Distributor1 PN: P1.00KLCT-ND; Value: 1K
R106 R128 R129 R138 = R0402_10K_±1%_0.1W_100PPM: SMD Resistor; Manufacturer1: Panasonic; Manufacturer1 PN: ERJ-2RKF1002X; TCR: 100ppm; Power Rating: 0.1W; Tolerance: ±1%; Case: 0402; Distributor1: DigiKey; Distributor1 PN: P10.0KLCT-ND; Value: 10K
R116 R127 R139 = R0402_22K_±1%_0.1W_100PPM: SMD Resistor; Manufacturer1: Panasonic; Manufacturer1 PN: ERJ-2RKF2202X; TCR: 100ppm; Power Rating: 0.1W; Tolerance: ±1%; Case: 0402; Distributor1: DigiKey; Distributor1 PN: P22.0KLCT-ND; Value: 22K

## Sheet Power_Supply.SchDoc
size A3
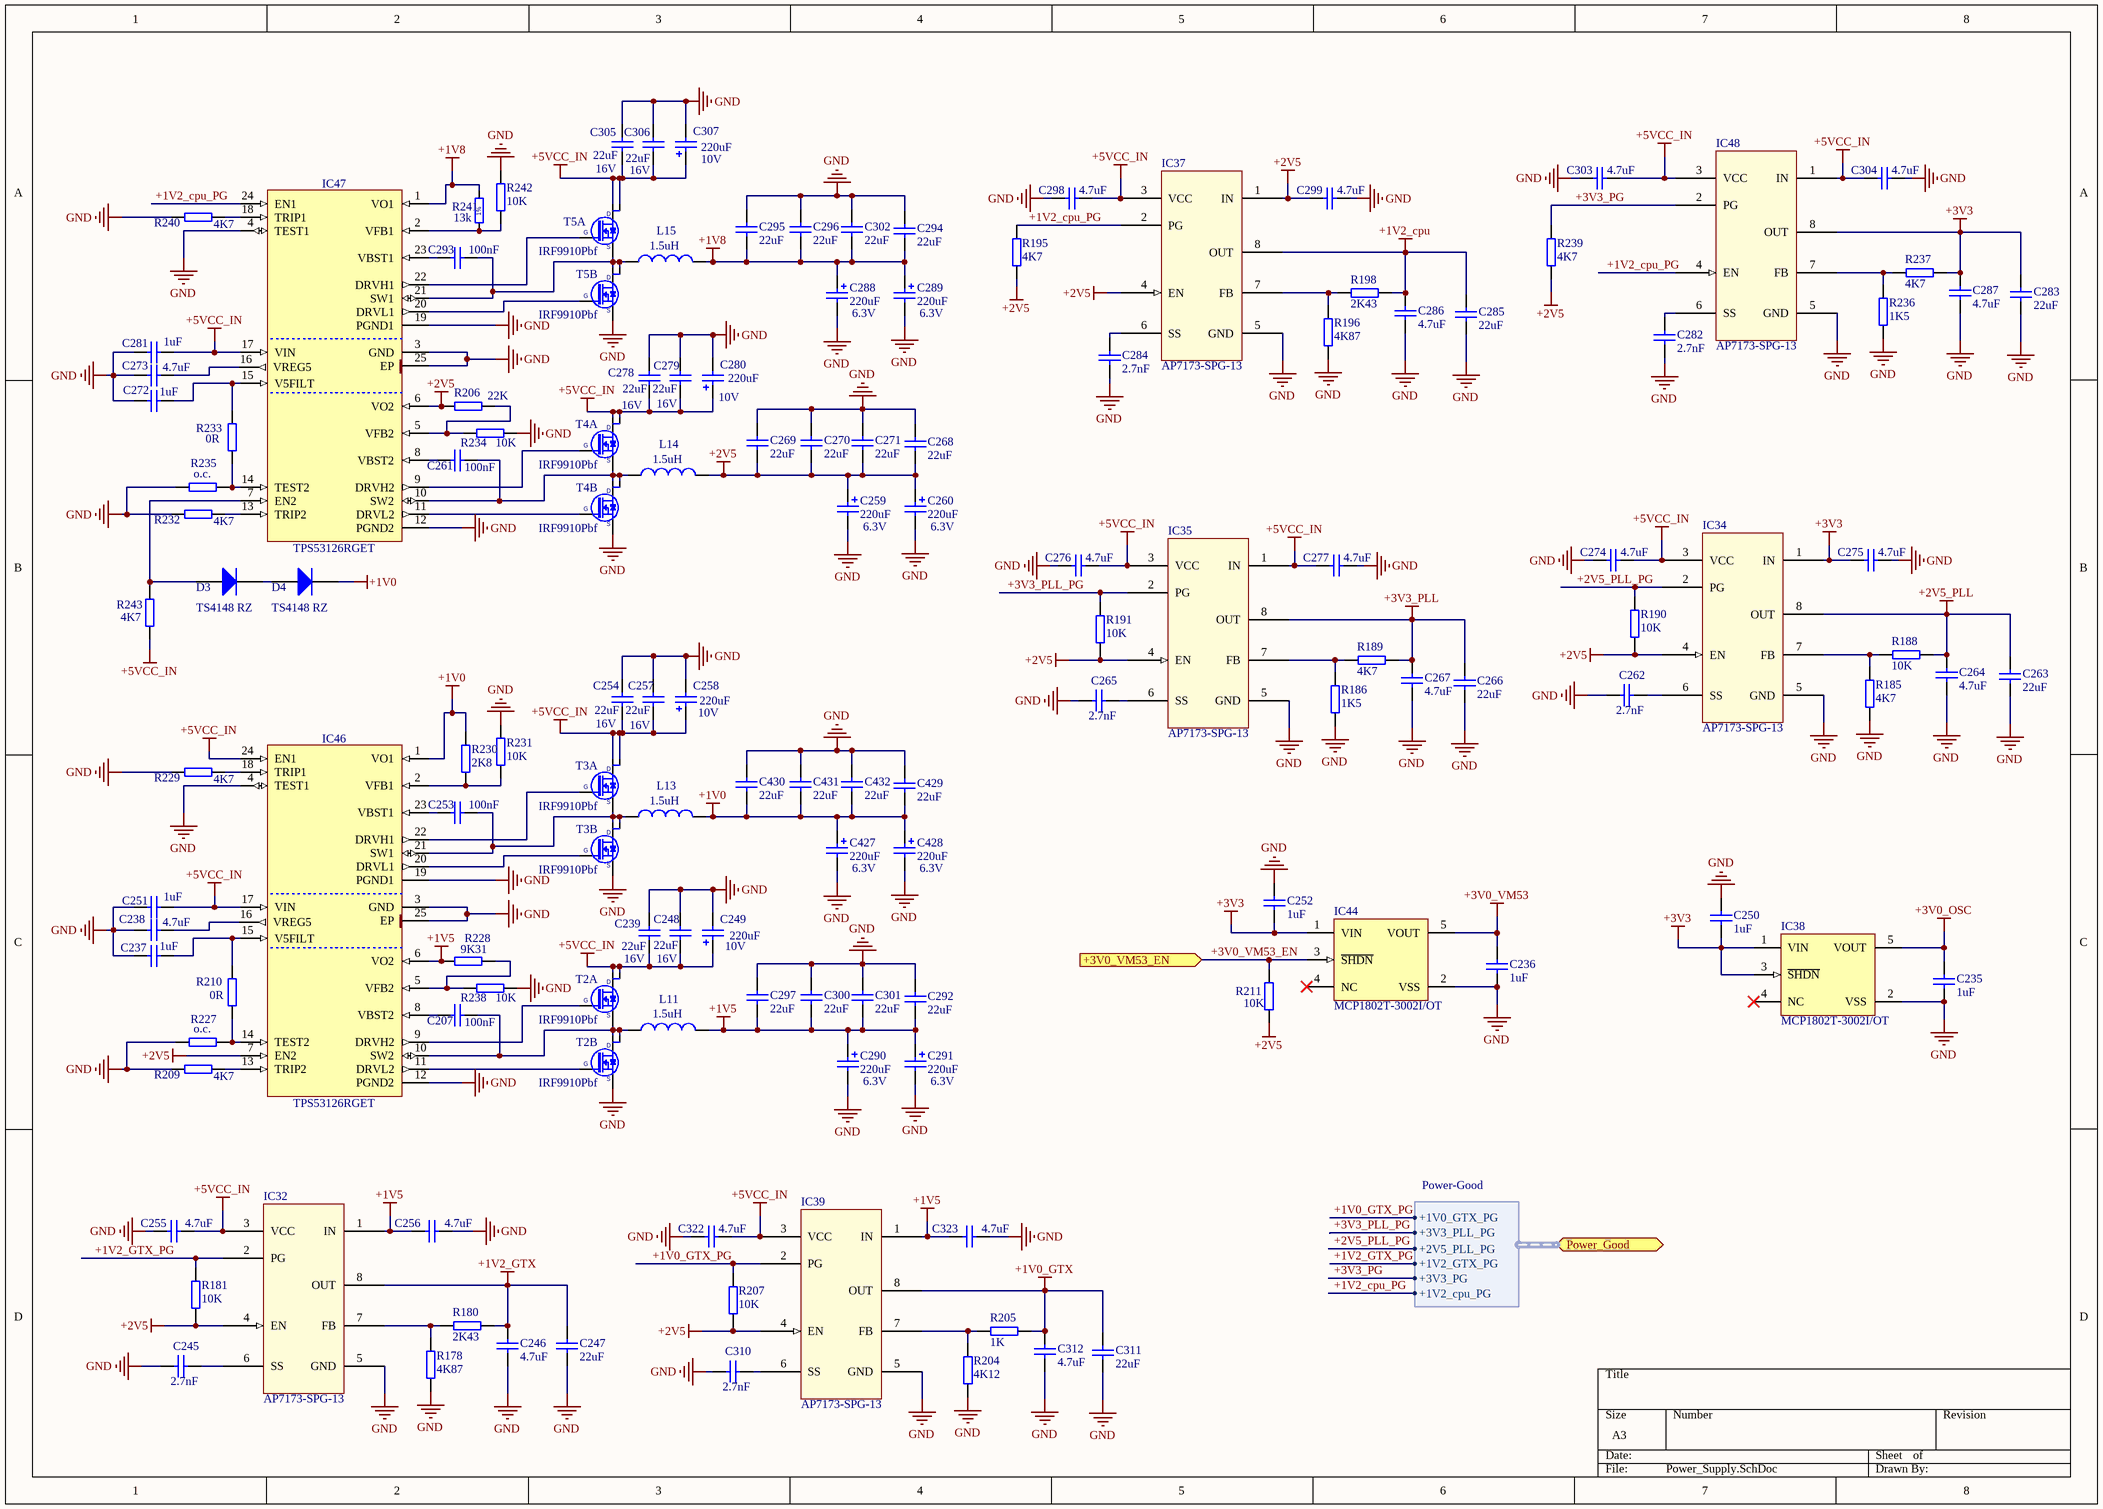
[diagram p17: Power_Supply.SchDoc]

### Parts
C207  100nF  [CC1005-0402]
C235  1uF  [CC1005-0402]
C236  1uF  [CC1005-0402]
C237  1uF  [CC1005-0402]
C238  4.7uF  [CC1608-0603]
C239  value 22uF  Voltage: 16V  [CC2012-0805]  (hidden comment: 22uF 16V)
C245  2.7nF  [CC1005-0402]
C246  4.7uF  [CC1608-0603]
C247  22uF  [CC2012-0805]
C248  value 22uF  Voltage: 16V  [CC2012-0805]  (hidden comment: 22uF 16V)
C249  value 220uF  Voltage: 10V  [D]  (hidden comment: 220uF 10V)
C250  1uF  [CC1005-0402]
C251  1uF  [CC1005-0402]
C252  1uF  [CC1005-0402]
C253  100nF  [CC1005-0402]
C254  value 22uF  Voltage: 16V  [CC2012-0805]  (hidden comment: 22uF 16V)
C255  4.7uF  [CC1608-0603]
C256  4.7uF  [CC1608-0603]
C257  value 22uF  Voltage: 16V  [CC2012-0805]  (hidden comment: 22uF 16V)
C258  value 220uF  Voltage: 10V  [D]  (hidden comment: 220uF 10V)
C259  Voltage: 6.3V  [D]  (hidden comment: 220uF)
C260  Voltage: 6.3V  [D]  (hidden comment: 220uF)
C261  100nF  [CC1005-0402]
C262  2.7nF  [CC1005-0402]
C263  22uF  [CC2012-0805]
C264  4.7uF  [CC1608-0603]
C265  2.7nF  [CC1005-0402]
C266  22uF  [CC2012-0805]
C267  4.7uF  [CC1608-0603]
C268  22uF  [CC2012-0805]
C269  22uF  [CC2012-0805]
C270  22uF  [CC2012-0805]
C271  22uF  [CC2012-0805]
C272  1uF  [CC1005-0402]
C273  4.7uF  [CC1608-0603]
C274  4.7uF  [CC1608-0603]
C275  4.7uF  [CC1608-0603]
C276  4.7uF  [CC1608-0603]
C277  4.7uF  [CC1608-0603]
C278  value 22uF  Voltage: 16V  [CC2012-0805]  (hidden comment: 22uF 16V)
C279  value 22uF  Voltage: 16V  [CC2012-0805]  (hidden comment: 22uF 16V)
C280  value 220uF  Voltage: 10V  [D]  (hidden comment: 220uF 10V)
C281  1uF  [CC1005-0402]
C282  2.7nF  [CC1005-0402]
C283  22uF  [CC2012-0805]
C284  2.7nF  [CC1005-0402]
C285  22uF  [CC2012-0805]
C286  4.7uF  [CC1608-0603]
C287  4.7uF  [CC1608-0603]
C288  Voltage: 6.3V  [D]  (hidden comment: 220uF)
C289  Voltage: 6.3V  [D]  (hidden comment: 220uF)
C290  Voltage: 6.3V  [D]  (hidden comment: 220uF)
C291  Voltage: 6.3V  [D]  (hidden comment: 220uF)
C292  22uF  [CC2012-0805]
C293  100nF  [CC1005-0402]
C294  22uF  [CC2012-0805]
C295  22uF  [CC2012-0805]
C296  22uF  [CC2012-0805]
C297  22uF  [CC2012-0805]
C298  4.7uF  [CC1608-0603]
C299  4.7uF  [CC1608-0603]
C300  22uF  [CC2012-0805]
C301  22uF  [CC2012-0805]
C302  22uF  [CC2012-0805]
C303  4.7uF  [CC1608-0603]
C304  4.7uF  [CC1608-0603]
C305  value 22uF  Voltage: 16V  [CC2012-0805]  (hidden comment: 22uF 16V)
C306  value 22uF  Voltage: 16V  [CC2012-0805]  (hidden comment: 22uF 16V)
C307  value 220uF  Voltage: 10V  [D]  (hidden comment: 220uF 10V)
C310  2.7nF  [CC1005-0402]
C311  22uF  [CC2012-0805]
C312  4.7uF  [CC1608-0603]
C322  4.7uF  [CC1608-0603]
C323  4.7uF  [CC1608-0603]
C427  Voltage: 6.3V  [D]  (hidden comment: 220uF)
C428  Voltage: 6.3V  [D]  (hidden comment: 220uF)
C429  22uF  [CC2012-0805]
C430  22uF  [CC2012-0805]
C431  22uF  [CC2012-0805]
C432  22uF  [CC2012-0805]
D3  TS4148 RZ  [CC1608-0603]
D4  TS4148 RZ  [CC1608-0603]
IC32  AP7173-SPG-13  [SOIC127P600-8AL]
IC34  AP7173-SPG-13  [SOIC127P600-8AL]
IC35  AP7173-SPG-13  [SOIC127P600-8AL]
IC37  AP7173-SPG-13  [SOIC127P600-8AL]
IC38  MCP1802T-3002I/OT  [SOT-23-OT5_N]
IC39  AP7173-SPG-13  [SOIC127P600-8AL]
IC44  MCP1802T-3002I/OT  [SOT-23-OT5_N]
IC46  TPS53126RGET  [QFN50P400X400X100-25N-S255]
IC47  TPS53126RGET  [QFN50P400X400X100-25N-S255]
IC48  AP7173-SPG-13  [SOIC127P600-8AL]
L11  value 1.5uH  [IHLP2525]  (hidden comment: IHLP2525CZER1R0M01)
L13  value 1.5uH  [IHLP2525]  (hidden comment: IHLP2525CZER1R0M01)
L14  value 1.5uH  [IHLP2525]  (hidden comment: IHLP2525CZER1R0M01)
L15  value 1.5uH  [IHLP2525]  (hidden comment: IHLP2525CZER1R0M01)
R178  4K87  [0402]
R180  2K43  [0402]
R181  10k  [0402]
R185  4K7  [0402]
R186  1K5  [0402]
R188  10K  [0402]
R189  4K7  [0402]
R190  10k  [0402]
R191  10k  [0402]
R195  4K7  [0402]
R196  4K87  [0402]
R198  2K43  [0402]
R204  4K12  [0402]
R205  1K  [0402]
R206  22K  [0402]
R207  10K  [0402]
R209  4K7  [0402]
R210  value 0R  [0402]  (hidden comment: Jumper)
R211  10k  [0402]
R227  o.c.  [0402]
R228  9K31  [0402]
R229  4K7  [0402]
R230  2K8  [0402]
R231  10K  [0402]
R232  4K7  [0402]
R233  value 0R  [0402]  (hidden comment: Jumper)
R234  10K  [0402]
R235  o.c.  [0402]
R236  1K5  [0402]
R237  4K7  [0402]
R238  10K  [0402]
R239  4K7  [0402]
R240  4K7  [0402]
R241  13k  [RESC1005X40N]
R242  10K  [0402]
R243  4K7  [0402]
T2  IRF9910Pbf  [SOIC127P600X175-8N]  (parts A,B of 2)
T3  IRF9910Pbf  [SOIC127P600X175-8N]  (parts A,B of 2)
T4  IRF9910Pbf  [SOIC127P600X175-8N]  (parts A,B of 2)
T5  IRF9910Pbf  [SOIC127P600X175-8N]  (parts A,B of 2)

### Ports
+3V0_VM53_EN (in), Power_Good (harness Power-Good)

### Harnesses
Power-Good: +1V2_GTX_PG, +2V5_PLL_PG, +3V3_PLL_PG, +1V0_GTX_PG, +3V3_PG, +1V2_cpu_PG

### Nets
+1V0: C427.1 C428.1 C429.1 C430.2 C431.1 C432.1 D4.2(K) IC46.1(VO1) L13.2 R230.2
+1V0_GTX: C311.2 C312.2 IC39.8(OUT) R205.2
+1V2_cpu: C285.2 C286.2 IC37.8(OUT) R198.2
+1V2_GTX: C246.2 C247.2 IC32.8(OUT) R180.2
+1V5: C256.1 C290.1 C291.1 C292.1 C297.2 C300.1 C301.1 C323.1 IC32.1(IN) IC39.1(IN) IC46.6(VO2) L11.2 R228.1
+1V8: C288.1 C289.1 C294.1 C295.2 C296.1 C302.1 IC47.1(VO1) L15.2 R241.2
+2V5: C259.1 C260.1 C268.1 C269.2 C270.1 C271.1 C299.1 IC32.4(EN) IC34.4(EN) IC35.4(EN) IC37.1(IN) IC37.4(EN) IC39.4(EN) IC46.7(EN2) IC47.6(VO2) L14.2 R181.1 R190.1 R191.1 R195.2 R206.2 R207.1 R211.2 R239.1
+2V5_PLL: C263.2 C264.2 IC34.8(OUT) R188.1
+3V0_OSC: C235.2 IC38.5(VOUT)
+3V0_VM53: C236.2 IC44.5(VOUT)
+3V3: C250.2 C252.2 C275.1 C283.2 C287.2 IC34.1(IN) IC38.1(VIN) IC38.3(~{SHDN}) IC44.1(VIN) IC48.8(OUT) R237.2
+3V3_PLL: C266.2 C267.2 IC35.8(OUT) R189.1
+5VCC_IN: C239.1 C248.1 C249.1 C251.2 C254.1 C255.2 C257.1 C258.1 C274.2 C276.2 C277.1 C278.1 C279.1 C280.1 C281.2 C298.2 C303.2 C304.1 C305.1 C306.1 C307.1 C322.2 IC32.3(VCC) IC34.3(VCC) IC35.1(IN) IC35.3(VCC) IC37.3(VCC) IC39.3(VCC) IC46.17(VIN) IC46.24(EN1) IC47.17(VIN) IC48.1(IN) IC48.3(VCC) R243.2 T2.5(D) T2.6(D) T3.5(D) T3.6(D) T4.5(D) T4.6(D) T5.5(D) T5.6(D)
GND: C235.1 C236.1 C237.1 C238.2 C239.2 C245.1 C246.1 C247.1 C248.2 C249.2 C250.1 C251.1 C252.1 C254.2 C255.1 C256.2 C257.2 C258.2 C259.2 C260.2 C262.1 C263.1 C264.1 C265.1 C266.1 C267.1 C268.2 C269.1 C270.2 C271.2 C272.1 C273.2 C274.1 C275.2 C276.1 C277.2 C278.2 C279.2 C280.2 C281.1 C282.1 C283.1 C284.1 C285.1 C286.1 C287.1 C288.2 C289.2 C290.2 C291.2 C292.2 C294.2 C295.1 C296.2 C297.1 C298.1 C299.2 C300.2 C301.2 C302.2 C303.1 C304.2 C305.2 C306.2 C307.2 C310.1 C311.1 C312.1 C322.1 C323.2 C427.2 C428.2 C429.2 C430.1 C431.2 C432.2 IC32.5(GND) IC34.5(GND) IC35.5(GND) IC37.5(GND) IC38.2(VSS) IC39.5(GND) IC44.2(VSS) IC46.3(GND) IC46.4(TEST1) IC46.12(PGND2) IC46.19(PGND1) IC46.25(EP) IC47.3(GND) IC47.4(TEST1) IC47.12(PGND2) IC47.19(PGND1) IC47.25(EP) IC48.5(GND) R178.1 R185.1 R186.1 R196.1 R204.1 R209.2 R227.1 R229.2 R231.2 R232.2 R234.2 R235.1 R236.1 R238.2 R240.2 R242.2 T2.1(S) T3.1(S) T4.1(S) T5.1(S)
+1V0_GTX_PG: IC39.2(PG) R207.2 ; port Power_Good.+1V0_GTX_PG
+1V2_cpu_PG: IC37.2(PG) IC47.24(EN1) IC48.4(EN) R195.1 ; port Power_Good.+1V2_cpu_PG
+1V2_GTX_PG: IC32.2(PG) R181.2 ; port Power_Good.+1V2_GTX_PG
+2V5_PLL_PG: IC34.2(PG) R190.2 ; port Power_Good.+2V5_PLL_PG
+3V0_VM53_EN: IC44.3(~{SHDN}) R211.1 ; port +3V0_VM53_EN
+3V3_PG: IC48.2(PG) R239.2 ; port Power_Good.+3V3_PG
+3V3_PLL_PG: IC35.2(PG) R191.2 ; port Power_Good.+3V3_PLL_PG
NetC207_1: C207.1 IC46.8(VBST2)
NetC207_2: C207.2 IC46.10(SW2) L11.1 T2.3(S) T2.7(D) T2.8(D)
NetC237_2: C237.2 IC46.15(V5FILT) R210.1
NetC238_1: C238.1 IC46.16(VREG5)
NetC245_2: C245.2 IC32.6(SS)
NetC253_1: C253.1 IC46.23(VBST1)
NetC253_2: C253.2 IC46.21(SW1) L13.1 T3.3(S) T3.7(D) T3.8(D)
NetC261_1: C261.1 IC47.8(VBST2)
NetC261_2: C261.2 IC47.10(SW2) L14.1 T4.3(S) T4.7(D) T4.8(D)
NetC262_2: C262.2 IC34.6(SS)
NetC265_2: C265.2 IC35.6(SS)
NetC272_2: C272.2 IC47.15(V5FILT) R233.1
NetC273_1: C273.1 IC47.16(VREG5)
NetC282_2: C282.2 IC48.6(SS)
NetC284_2: C284.2 IC37.6(SS)
NetC293_1: C293.1 IC47.23(VBST1)
NetC293_2: C293.2 IC47.21(SW1) L15.1 T5.3(S) T5.7(D) T5.8(D)
NetC310_2: C310.2 IC39.6(SS)
NetD3_1: D3.1(A) IC47.7(EN2) R243.1
NetD3_2: D3.2(K) D4.1(A)
NetIC32_7: IC32.7(FB) R178.2 R180.1
NetIC34_7: IC34.7(FB) R185.2 R188.2
NetIC35_7: IC35.7(FB) R186.2 R189.2
NetIC37_7: IC37.7(FB) R196.2 R198.1
NetIC39_7: IC39.7(FB) R204.2 R205.1
NetIC46_2: IC46.2(VFB1) R230.1 R231.1
NetIC46_5: IC46.5(VFB2) R228.2 R238.1
NetIC46_9: IC46.9(DRVH2) T2.4(G)
NetIC46_11: IC46.11(DRVL2) T2.2(G)
NetIC46_13: IC46.13(TRIP2) R209.1
NetIC46_14: IC46.14(TEST2) R210.2 R227.2
NetIC46_18: IC46.18(TRIP1) R229.1
NetIC46_20: IC46.20(DRVL1) T3.2(G)
NetIC46_22: IC46.22(DRVH1) T3.4(G)
NetIC47_2: IC47.2(VFB1) R241.1 R242.1
NetIC47_5: IC47.5(VFB2) R206.1 R234.1
NetIC47_9: IC47.9(DRVH2) T4.4(G)
NetIC47_11: IC47.11(DRVL2) T4.2(G)
NetIC47_13: IC47.13(TRIP2) R232.1
NetIC47_14: IC47.14(TEST2) R233.2 R235.2
NetIC47_18: IC47.18(TRIP1) R240.1
NetIC47_20: IC47.20(DRVL1) T5.2(G)
NetIC47_22: IC47.22(DRVH1) T5.4(G)
NetIC48_7: IC48.7(FB) R236.2 R237.1

Not connected (* = marked no-connect by the designer): IC38 4(NC)*; IC44 4(NC)*

### Notes on the sheet
- (in symbol R0402_13K_1%_0.0625W_100PPM) 1%

### Library data of the parts
C207 C253 C261 C293 = CC0402_100NF_16V_10%_X7R: as C141 on sheet SCB_PLLs; Published: 8-Jun-2000; LatestRevisionDate: 17-Jul-2002; LatestRevisionNote: Re-released for DXP Platform.; PackageReference: RAD-0.3; Publisher: Altium Limited; Distributor1: Digikey; Distributor1 PN: 445-4952-1-ND; Case: 0402; Value: 100nF
C235-C237 C250-C252 C272 C281 = CC0402_1UF_16V_10%_X5R: Capacitor; Manufacturer1: TDK; Manufacturer1 PN: C1005X5R1C105K; TC: X5R; Tolerance: ±10%; Voltage: 16V; Published: 8-Jun-2000; LatestRevisionDate: 17-Jul-2002; LatestRevisionNote: Re-released for DXP Platform.; PackageReference: RAD-0.3; Publisher: Altium Limited; Distributor1: Digikey; Distributor1 PN: 445-4978-1-ND; Case: 0402; Value: 1uF
C238 C246 C255 C256 C264 C267 C273-C277 C286 C287 C298 C299 C303 C304 C312 C322 C323 = CC0603_4.7UF_10V_10%_X5R: Capacitor; Manufacturer1: TDK; Manufacturer1 PN: C1608X5R1A475K; TC: X5R; Tolerance: ±10%; Voltage: 10V; Published: 8-Jun-2000; LatestRevisionDate: 17-Jul-2002; LatestRevisionNote: Re-released for DXP Platform.; PackageReference: RAD-0.3; Publisher: Altium Limited; Distributor1: Digikey; Distributor1 PN: 445-5170-1-ND; Case: 0603; Value: 4.7uF
C239 C248 C254 C257 C278 C279 C305 C306 = CC0805_22UF_16V_10%_X5R: Capacitor; Manufacturer1: Phycomp; Manufacturer1 PN: C2012X5R1C226K; TC: X7R; Tolerance: ±10%; Published: 8-Jun-2000; LatestRevisionDate: 17-Jul-2002; LatestRevisionNote: Re-released for DXP Platform.; PackageReference: RAD-0.3; Publisher: Altium Limited; Distributor1: Digikey; Distributor1 PN: 445-6797-1-ND; Case: 0805
C245 C262 C265 C282 C284 C310 = CC0402_2.7NF_50V_10%_X7R: Capacitor; Manufacturer1: Panasonic; Manufacturer1 PN: ECJ-0EB1H272K; TC: X7R; Tolerance: ±10%; Voltage: 50V; Published: 8-Jun-2000; LatestRevisionDate: 17-Jul-2002; LatestRevisionNote: Re-released for DXP Platform.; PackageReference: RAD-0.3; Publisher: Altium Limited; Distributor1: Digikey; Distributor1 PN: PCC1726CT-ND; Case: 0402; Value: 2.7nF
C247 C263 C266 C268-C271 C283 C285 C292 C294-C297 C300-C302 C311 C429-C432 = CC0805_22UF_6.3V_20%_X5R: Capacitor; Manufacturer1: TDK; Manufacturer1 PN: C2012X5R0J226M; TC: X5R; Tolerance: ±20%; Voltage: 6.3V; Published: 8-Jun-2000; LatestRevisionDate: 17-Jul-2002; LatestRevisionNote: Re-released for DXP Platform.; PackageReference: RAD-0.3; Publisher: Altium Limited; Distributor1: Digikey; Distributor1 PN: 445-1422-1-ND; Case: 0805; Value: 22uF
C249 C258 C280 C307 = CP2917_220UF_10V_20%_TANT: Polarized Capacitor Tantalum; Manufacturer1: Kemet; Manufacturer1 PN: T520D227M010ATE018; Tolerance: ±20%; ESR: 18mOhm; Published: 8-Jun-2000; LatestRevisionDate: 17-Jul-2002; LatestRevisionNote: Re-released for DXP Platform.; PackageReference: RB7.6-15; Publisher: Altium Limited; Case: 2917; Distributor1: Digikey; Distributor1 PN: 399-4045-1-ND; TC: Tantalum
C259 C260 C288-C291 C427 C428 = CP2917_220UF_6.3V_20%_TANT: Polarized Capacitor Tantalum; Manufacturer1: Kemet; Manufacturer1 PN: T520D227M006ATE009; Tolerance: ±20%; ESR: 9mOhm; Published: 8-Jun-2000; LatestRevisionDate: 17-Jul-2002; LatestRevisionNote: Re-released for DXP Platform.; PackageReference: RB7.6-15; Publisher: Altium Limited; Case: 2917; Distributor1: Digikey; Distributor1 PN: T520D227M006ATE009; TC: Tantalum; Value: 220uF
D3 D4 = Diode: Default Diode; Published: 8-Jun-2000; LatestRevisionDate: 17-Jul-2002; LatestRevisionNote: Re-released for DXP Platform.; PackageDocument: Sep-1996; PackageReference: SMC; Publisher: Altium Limited; Code_JEDEC: DO-214-AB; Value: TS4148 RZ; Distributor1 PN: 8150192; Distributor1: Farnell
IC32 IC34 IC35 IC37 IC39 IC48 = AP7173: 1.5A Low Dropout Linera Regulator; Value: AP7173-SPG-13; Distributor1 PN: AP7173-SPG-13DICT-ND; Distributor1: Digikey
IC38 IC44 = MCP1802T-3002I/OT: 300 mA, High PSRR, Low Quiescent Current LDO, 5-Pin SOT-23, Industrial Temperature, Tape and Reel; FirstPublished: 29-Jan-2009; LatestRevisionDate: 02-Dec-2009; LatestRevisionNote: Updated to datasheet revision B, Jan-2009; DatasheetVersion: revB, Jan-2009; PackageVersion: revBB, Aug-2009; PackageReference: SOT-23-OT5; Publisher: Altium Limited; PackageDescription: 5-Lead Plastic Small Outline Transistor (OT) [SOT-23]; Supplier 1: Digi-Key; Supplier Part Number 1: MCP1802T-3002I/OTTR-ND; Supplier 2: Digi-Key; Supplier Part Number 2: MCP1802T-3002I/OTCT-ND; Supplier 3: Digi-Key; Supplier Part Number 3: MCP1802T-3002I/OTDKR-ND; Supplier 4: Farnell; Supplier Part Number 4: 1578373; Supplier 5: Newark; Supplier Part Number 5: 54M4837; Code_IPC: SOT23-5; ComponentLink1Description: Datasheet; ComponentLink1URL: http://ww1.microchip.com/downloads/en/DeviceDoc/22053b.pdf; ComponentLink2Description: Packaging Specification; ComponentLink2URL: http://www.microchip.com/stellent/groups/techpub_sg/documents/packagingspec/en012702.pdf; ComponentLink3Description: Microchip.com Home; ComponentLink3URL: http://www.microchip.com/
IC46 IC47 = TPS53126RGET: Dual Synchronous Step-Down Controller For Low Voltage Power Rails; Manufacturer: TEXAS INSTRUMENTS; Table: Analog & Interface; Part Number: TPS53126RGET; Component Kind: Standard; Component Type: Standard; Device: TPS53126RGET; PackageDescription: QFN,0.50mm pitch,square;6 pin X 6 pin,4.15mm X 4.15mm X 1.00mm H body (w/thermal tab 2.55 X 2.55mm),  IPC Medium Density; Part Description: Dual Synchronous Step-Down Controller For Low Voltage Power Rails; Manufacturer Part Number: TPS53126RGET; Pin Count: 25; Case: QFN24; Mounted: Yes; Socket: No; SMD: Yes; ComponentHeight: 1.0mm; Author: CERN DEM JLC; HelpURL: \\cern.ch\dfs\Applications\Altium\Datasheets\TPS53126RGET.pdf; CreateDate: 2010-08-26; LatestRevisionDate: 2010-08-26
L11 L13-L15 = Inductor: Low Profile, High Current Inductor; Manufacturer PN: IHLP2525CZER1R5M01; Manufacturer: Vishay/Dale; Published: 8-Jun-2000; Revision: July-2002: Re-released for DXP Platform.; Publisher: Altium Limited; Distributor1 PN: 541-1007-1-ND; Distributor1: Digikey
R178 R196 = R0402_4K87_±1%_0.1W_100PPM: SMD Resistor; Manufacturer1: Panasonic; Manufacturer1 PN: ERJ-2RKF4871X; TCR: 100ppm; Power Rating: 0.1W; Tolerance: ±1%; Case: 0402; Distributor1: DigiKey; Distributor1 PN: P4.87KLCT-ND; Value: 4K87
R180 R198 = R0402_2K43_±1%_0.1W_100PPM: SMD Resistor; Manufacturer1: Panasonic; Manufacturer1 PN: ERJ-2RKF2431X; TCR: 100ppm; Power Rating: 0.1W; Tolerance: ±1%; Case: 0402; Distributor1: DigiKey; Distributor1 PN: P2.43KLCT-ND; Value: 2K43
R181 R188 R190 R191 R207 R211 R231 R234 R238 R242 = R0402_10K_±1%_0.1W_100PPM: as R106 on sheet FPGA_System_Monitor; Case: 0402; Distributor1: DigiKey; Distributor1 PN: P10.0KLCT-ND; Value: 10K
R185 R189 R195 R209 R229 R232 R237 R239 R240 R243 = R0402_4.7K_±1%_0.1W_100PPM: as R100 on sheet FPGA_System_Monitor; Case: 0402; Distributor1: DigiKey; Distributor1 PN: ERJ-2RKF4701X; Value: 4K7
R186 R236 = R0402_1K5_±1%_0.1W_100PPM: SMD Resistor; Manufacturer1: Panasonic; Manufacturer1 PN: ERJ-2RKF1501X; TCR: 100ppm; Power Rating: 0.1W; Tolerance: ±1%; Case: 0402; Distributor1: DigiKey; Distributor1 PN: P1.50KLCT-ND; Value: 1K5
R204 = R0402_4K12_±1%_0.1W_100PPM: as R83 on sheet SCB_PLLs; Case: 0402; Distributor1: DigiKey; Distributor1 PN: P4.12KLCT-ND; Value: 4K12
R205 = R0402_1K_±1%_0.1W_100PPM: as R160-R163 on sheet CPU_IO_Ports; Case: 0402; Distributor1: DigiKey; Distributor1 PN: P1.00KLCT-ND; Value: 1K
R206 = R0402_22K_±1%_0.1W_100PPM: as R116 on sheet FPGA_System_Monitor; Case: 0402; Distributor1: DigiKey; Distributor1 PN: P22.0KLCT-ND; Value: 22K
R210 R233 = R0402_0R_0.1W_JUMPER: as R61 on sheet SCB_PLLs; Case: 0402; Distributor1: DigiKey; Distributor1 PN: P0.0JCT-ND; Tolerance: Jumper
R227 R235 = R0402_O.C.: SMD Resistor; Case: 0402; Manufacturer1: N/A; Manufacturer1 PN: N/A; Distributor1: N/A; Distributor1 PN: N/A; TCR: N/A; Power Rating: N/A; Tolerance: N/A; Value: o.c.
R228 = R0402_9K31_±1%_0.1W_100PPM: SMD Resistor; Manufacturer1: Panasonic; Manufacturer1 PN: ERJ-2RKF9311X; TCR: 100ppm; Power Rating: 0.1W; Tolerance: ±1%; Case: 0402; Distributor1: DigiKey; Distributor1 PN: P9.31KLCT-ND; Value: 9K31
R230 = R0402_2K8_±1%_0.1W_100PPM: SMD Resistor; Manufacturer1: Panasonic; Manufacturer1 PN: ERJ-2RKF2801X; TCR: 100ppm; Power Rating: 0.1W; Tolerance: ±1%; Case: 0402; Distributor1: DigiKey; Distributor1 PN: P2.80KLCT-ND; Value: 2K8
R241 = R0402_13K_1%_0.0625W_100PPM: Resistor - 1%; Part Description: General Purpose Thick Film Chip Resistor; Manufacturer: GENERIC; Manufacturer1 Part Number: 232270671303; TC: ±100ppm/°C; Table: Resistors SMD; Part Number: R0402_13K_1%_0.0625W_100PPM; Component Kind: Standard; Component Type: Standard; Pin Count: 2; Value: 13k; Status: Not recommended; Power: 0.0625W; Tolerance: ±1%; Manufacturer Part Number: R0402_13K_1%_0.0625W_100PPM; Case: 0402; Mounted: Yes; Socket: No; SMD: Yes; Manufacturer1 Example: PHYCOMP; Manufacturer1 ComponentHeight: 0.4mm; HelpURL: \\cern.ch\dfs\Applications\Altium\Datasheets\R0402_Phycomp_RC0402.pdf; Author: CERN DEM JLC; CreateDate: 03/12/2007; LatestRevisionDate: 13/03/2008
T2-T5 = IRF9910Pbf: Dual SO-8 MOSFET For POL Cconverter; Part Description: 20V 10A(Q1) 20V 12A (Q2) Dual SO-8 MOSFET For POL Cconverter; Manufacturer: INTERNATIONAL RECTIFIER; Table: Transistors; Part Number: IRF9910Pbf; Component Kind: Standard; Component Type: Standard; Device: IRF9910Pbf; PackageDescription: SOIC 8, Pitch 1.27mm - Body 4x5mm, IPC Medium Density; Manufacturer Part Number: IRF9910Pbf; Pin Count: 8; Case: DO8; Mounted: Yes; Socket: No; SMD: Yes; ComponentHeight: 1.75mm; HelpURL: \\cern.ch\dfs\Applications\Altium\Datasheets\IRF9910Pbf.pdf; Author: CERN DEM JLC; CreateDate: 30/08/2010; LatestRevisionDate: 30/08/2010